# EAGLE design leistung (EAGLE 9.1.3)

## Sheet 1 of 7: connectors
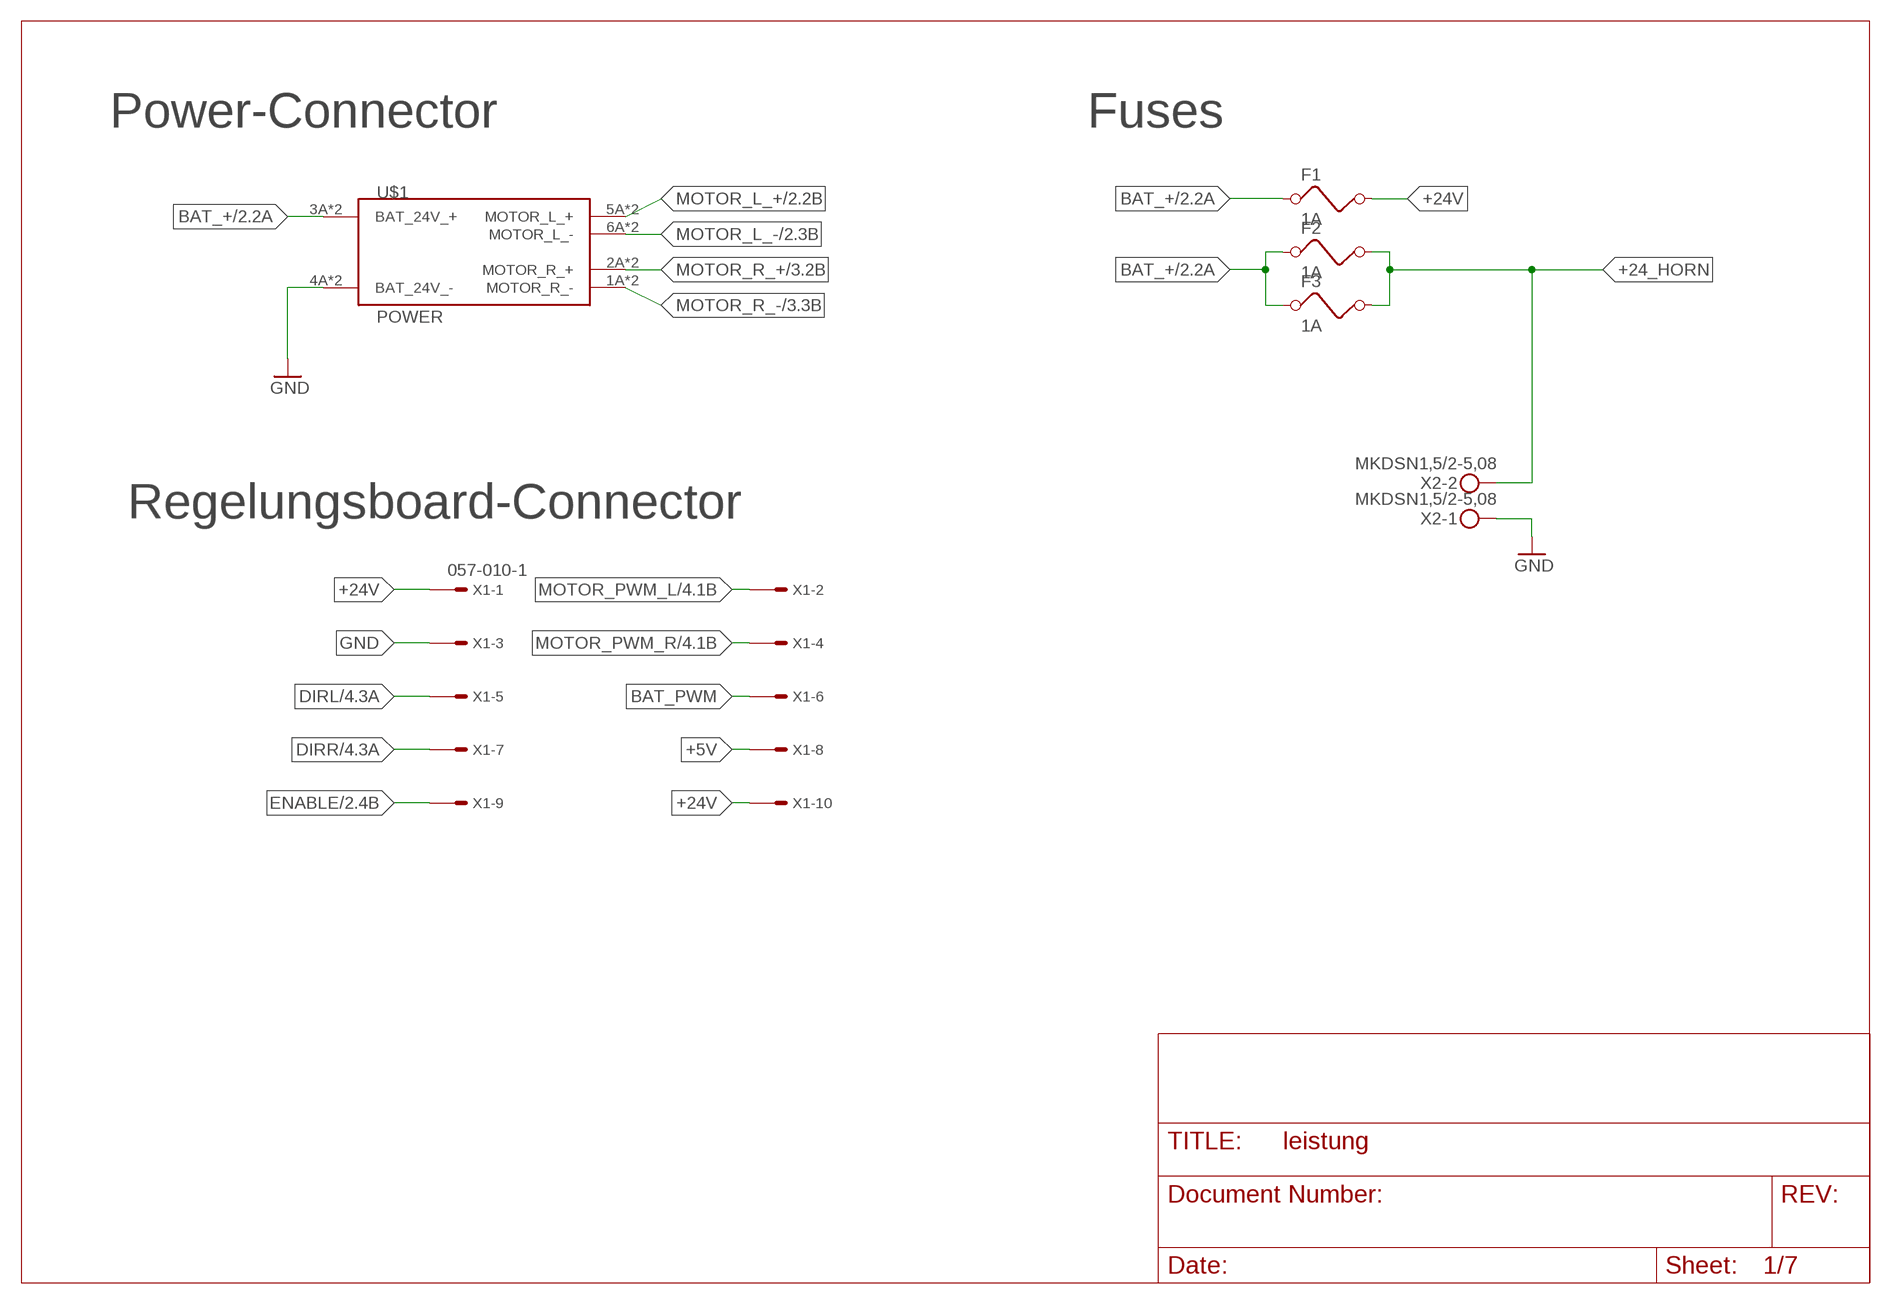
[diagram p0: schematic, sheet 1]

### Parts
F1  1A  FUSE  [FUSE]
F2  1A  FUSE  [FUSE]
F3  1A  FUSE  [FUSE]
U$1  POWER  [CON_POWER]
X1  057-010-1  [057-010-1]
X2  MKDSN1,5/2-5,08  [MKDSN1,5/2-5,08]

### Nets
+5V: X1.8 ; also sheet 4,5,7
+24_HORN: F2.2 F3.2 X2.2
+24V: F1.2 X1.1 X1.10 ; also sheet 5,6,7
BAT_+: F1.1 F2.1 F3.1 U$1.3A(BAT_24V_+) U$1.3B(BAT_24V_+) ; also sheet 2,3
BAT_PWM: X1.6 ; also sheet 7
DIRL: X1.5 ; also sheet 4
DIRR: X1.7 ; also sheet 4
ENABLE: X1.9 ; also sheet 2,3
GND: U$1.4A(BAT_24V_-) U$1.4B(BAT_24V_-) X1.3 X2.1 ; also sheet 2,3,4,5,6,7
MOTOR_L_+: U$1.5A(MOTOR_L_+) U$1.5B(MOTOR_L_+) ; also sheet 2
MOTOR_L_-: U$1.6A(MOTOR_L_-) U$1.6B(MOTOR_L_-) ; also sheet 2
MOTOR_PWM_L: X1.2 ; also sheet 4
MOTOR_PWM_R: X1.4 ; also sheet 4
MOTOR_R_+: U$1.2A(MOTOR_R_+) U$1.2B(MOTOR_R_+) ; also sheet 3
MOTOR_R_-: U$1.1A(MOTOR_R_-) U$1.1B(MOTOR_R_-) ; also sheet 3

### Notes on the sheet
- Power-Connector | Fuses
- Regelungsboard-Connector

## Sheet 2 of 7: h-bridge-left
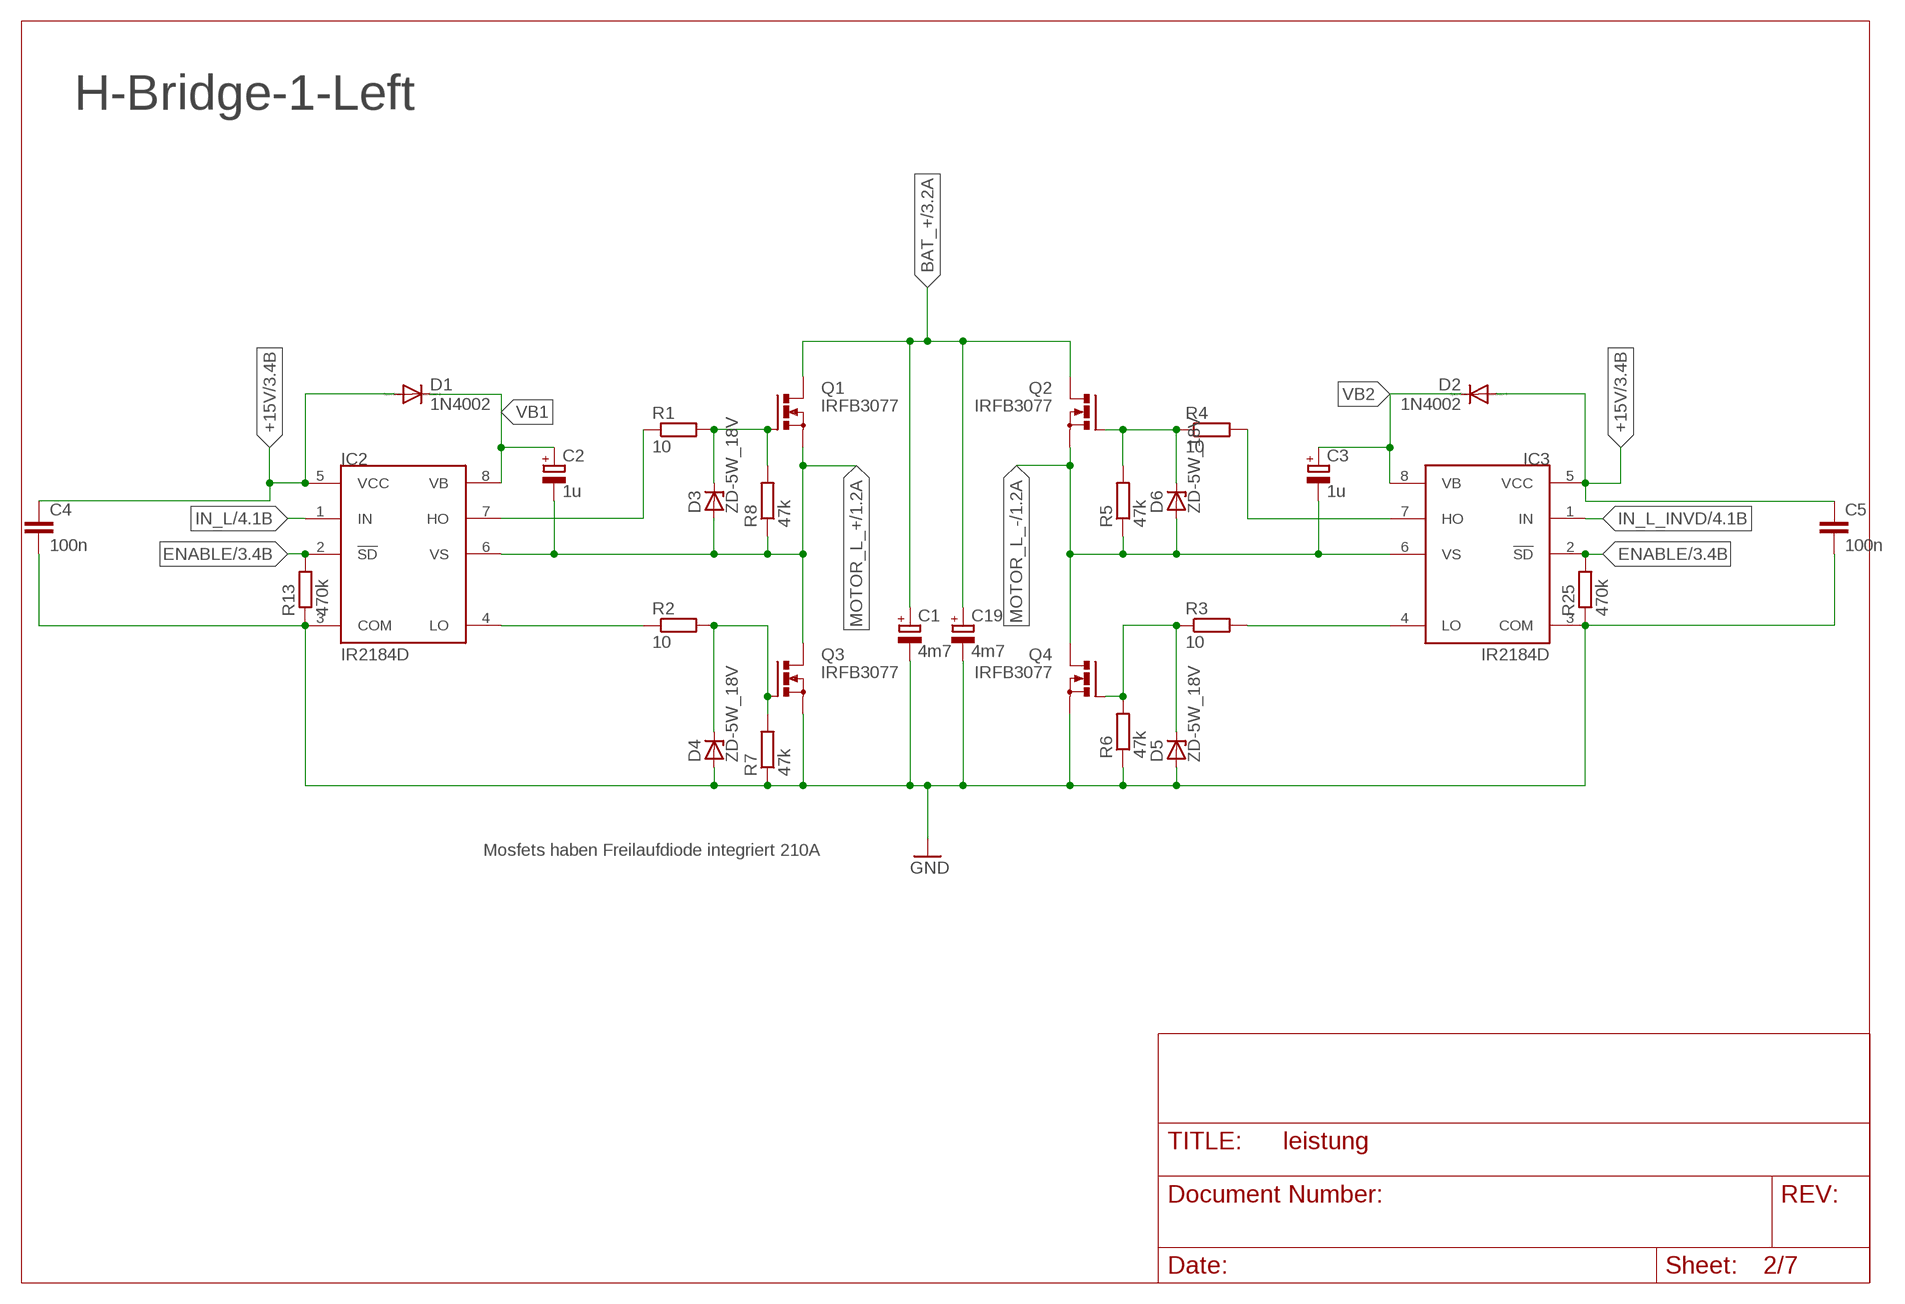
[diagram p1: schematic, sheet 2]

### Parts
C1  4m7  CPOL-EUE7.5-18  [E7,5-18]
C2  1u  CPOL-EUE2.5-5  [E2,5-5]
C3  1u  CPOL-EUE2.5-5  [E2,5-5]
C4  100n  C-EU025-025X050  [C025-025X050]
C5  100n  C-EU025-025X050  [C025-025X050]
C19  4m7  CPOL-EUE7.5-18  [E7,5-18]
D1  1N4002  1N4004  [DO41-10]
D2  1N4002  1N4004  [DO41-10]
D3  ZD-5W_18V  ZENER-DIODEZD-10  [ZDIO-10]
D4  ZD-5W_18V  ZENER-DIODEZD-10  [ZDIO-10]
D5  ZD-5W_18V  ZENER-DIODEZD-10  [ZDIO-10]
D6  ZD-5W_18V  ZENER-DIODEZD-10  [ZDIO-10]
IC2  IR2184D  [DIL08]
IC3  IR2184D  [DIL08]
Q1  IRFB3077  PMOSFET_NTO220BV  [TO220BV]
Q2  IRFB3077  PMOSFET_NTO220BV  [TO220BV]
Q3  IRFB3077  PMOSFET_NTO220BV  [TO220BV]
Q4  IRFB3077  PMOSFET_NTO220BV  [TO220BV]
R1  10  R-EU_0207/7  [0207/7]
R2  10  R-EU_0207/7  [0207/7]
R3  10  R-EU_0207/7  [0207/7]
R4  10  R-EU_0207/7  [0207/7]
R5  47k  R-EU_0207/7  [0207/7]
R6  47k  R-EU_0207/7  [0207/7]
R7  47k  R-EU_0207/7  [0207/7]
R8  47k  R-EU_0207/7  [0207/7]
R13  470k  R-EU_0207/7  [0207/7]
R25  470k  R-EU_0207/7  [0207/7]

### Nets
+15V: C4.1 C5.1 D1.A D2.A IC2.5(VCC) IC3.5(VCC) ; also sheet 3,6
BAT_+: C1.+ C19.+ Q1.D Q2.D ; also sheet 1,3
ENABLE: IC2.2(!SD) IC3.2(!SD) R13.2 R25.2 ; also sheet 1,3
GND: C1.- C4.2 C5.2 C19.- D4.A D5.A IC2.3(COM) IC3.3(COM) Q3.S Q4.S R6.1 R7.1 R13.1 R25.1 ; also sheet 1,3,4,5,6,7
IN_L: IC2.1(IN) ; also sheet 4
IN_L_INVD: IC3.1(IN) ; also sheet 4
MOTOR_L_+: C2.- D3.A IC2.6(VS) Q1.S Q3.D R8.1 ; also sheet 1
MOTOR_L_-: C3.- D6.A IC3.6(VS) Q2.S Q4.D R5.1 ; also sheet 1
N$5: D4.C Q3.G R2.2 R7.2
N$6: D3.C Q1.G R1.2 R8.2
N$7: D6.C Q2.G R4.1 R5.2
N$8: D5.C Q4.G R3.1 R6.2
N$9: IC2.4(LO) R2.1
N$10: IC2.7(HO) R1.1
N$11: IC3.7(HO) R4.2
N$12: IC3.4(LO) R3.2
VB1: C2.+ D1.C IC2.8(VB)
VB2: C3.+ D2.C IC3.8(VB)

### Notes on the sheet
- H-Bridge-1-Left
- Mosfets haben Freilaufdiode integriert 210A

## Sheet 3 of 7: h-bridge-right
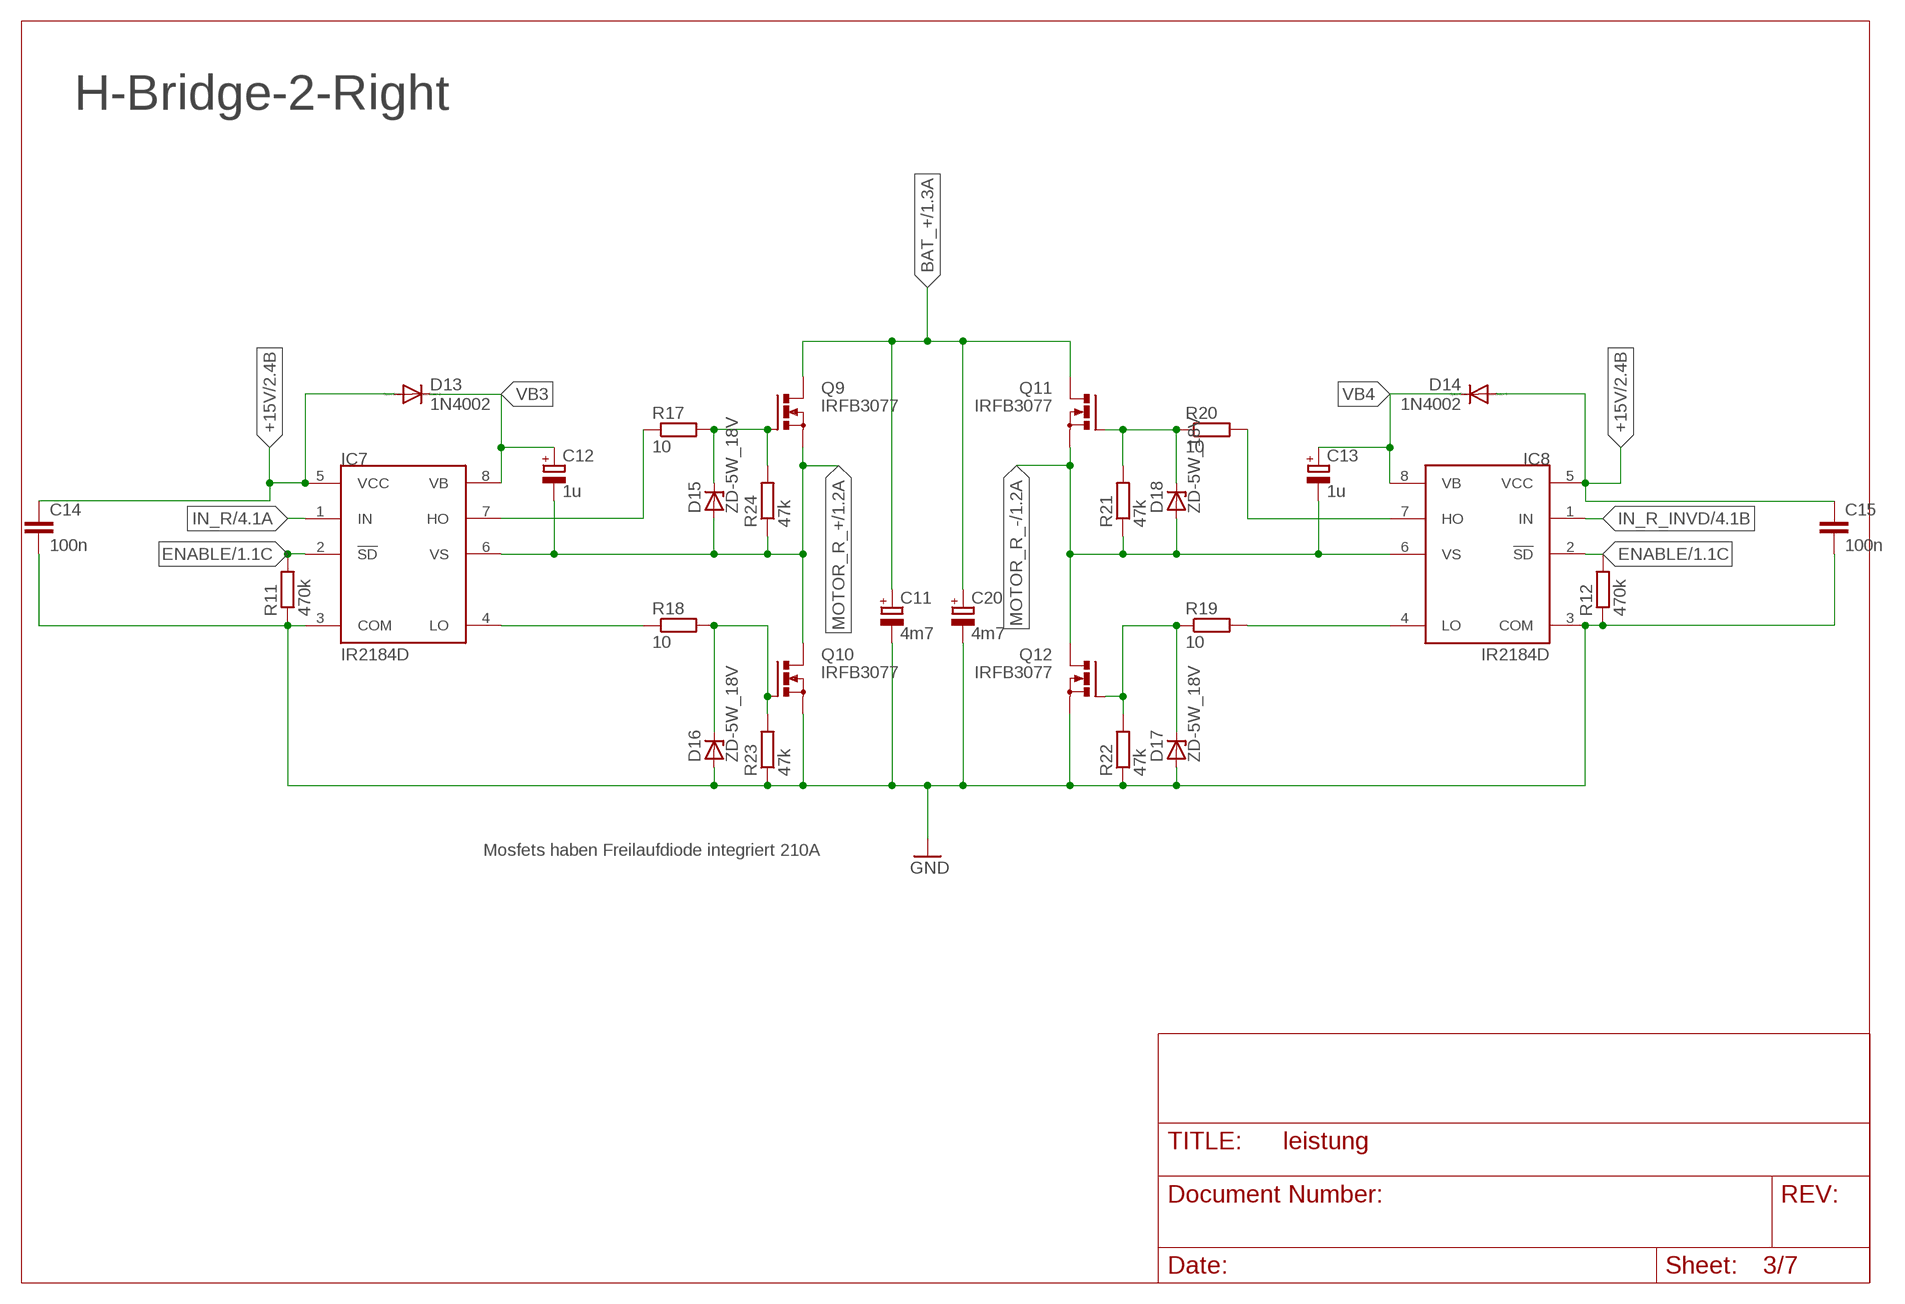
[diagram p2: schematic, sheet 3]

### Parts
C11  4m7  CPOL-EUE7.5-18  [E7,5-18]
C12  1u  CPOL-EUE2.5-5  [E2,5-5]
C13  1u  CPOL-EUE2.5-5  [E2,5-5]
C14  100n  C-EU025-025X050  [C025-025X050]
C15  100n  C-EU025-025X050  [C025-025X050]
C20  4m7  CPOL-EUE7.5-18  [E7,5-18]
D13  1N4002  1N4004  [DO41-10]
D14  1N4002  1N4004  [DO41-10]
D15  ZD-5W_18V  ZENER-DIODEZD-10  [ZDIO-10]
D16  ZD-5W_18V  ZENER-DIODEZD-10  [ZDIO-10]
D17  ZD-5W_18V  ZENER-DIODEZD-10  [ZDIO-10]
D18  ZD-5W_18V  ZENER-DIODEZD-10  [ZDIO-10]
IC7  IR2184D  [DIL08]
IC8  IR2184D  [DIL08]
Q9  IRFB3077  PMOSFET_NTO220BV  [TO220BV]
Q10  IRFB3077  PMOSFET_NTO220BV  [TO220BV]
Q11  IRFB3077  PMOSFET_NTO220BV  [TO220BV]
Q12  IRFB3077  PMOSFET_NTO220BV  [TO220BV]
R11  470k  R-EU_0207/7  [0207/7]
R12  470k  R-EU_0207/7  [0207/7]
R17  10  R-EU_0207/7  [0207/7]
R18  10  R-EU_0207/7  [0207/7]
R19  10  R-EU_0207/7  [0207/7]
R20  10  R-EU_0207/7  [0207/7]
R21  47k  R-EU_0207/7  [0207/7]
R22  47k  R-EU_0207/7  [0207/7]
R23  47k  R-EU_0207/7  [0207/7]
R24  47k  R-EU_0207/7  [0207/7]

### Nets
+15V: C14.1 C15.1 D13.A D14.A IC7.5(VCC) IC8.5(VCC) ; also sheet 2,6
BAT_+: C11.+ C20.+ Q9.D Q11.D ; also sheet 1,2
ENABLE: IC7.2(!SD) IC8.2(!SD) R11.2 R12.2 ; also sheet 1,2
GND: C11.- C14.2 C15.2 C20.- D16.A D17.A IC7.3(COM) IC8.3(COM) Q10.S Q12.S R11.1 R12.1 R22.1 R23.1 ; also sheet 1,2,4,5,6,7
IN_R: IC7.1(IN) ; also sheet 4
IN_R_INVD: IC8.1(IN) ; also sheet 4
MOTOR_R_+: C12.- D15.A IC7.6(VS) Q9.S Q10.D R24.1 ; also sheet 1
MOTOR_R_-: C13.- D18.A IC8.6(VS) Q11.S Q12.D R21.1 ; also sheet 1
N$13: D16.C Q10.G R18.2 R23.2
N$30: D15.C Q9.G R17.2 R24.2
N$31: D18.C Q11.G R20.1 R21.2
N$32: D17.C Q12.G R19.1 R22.2
N$33: IC7.4(LO) R18.1
N$34: IC7.7(HO) R17.1
N$35: IC8.7(HO) R20.2
N$36: IC8.4(LO) R19.2
VB3: C12.+ D13.C IC7.8(VB)
VB4: C13.+ D14.C IC8.8(VB)

### Notes on the sheet
- H-Bridge-2-Right
- Mosfets haben Freilaufdiode integriert 210A

## Sheet 4 of 7: driver-logic-gates
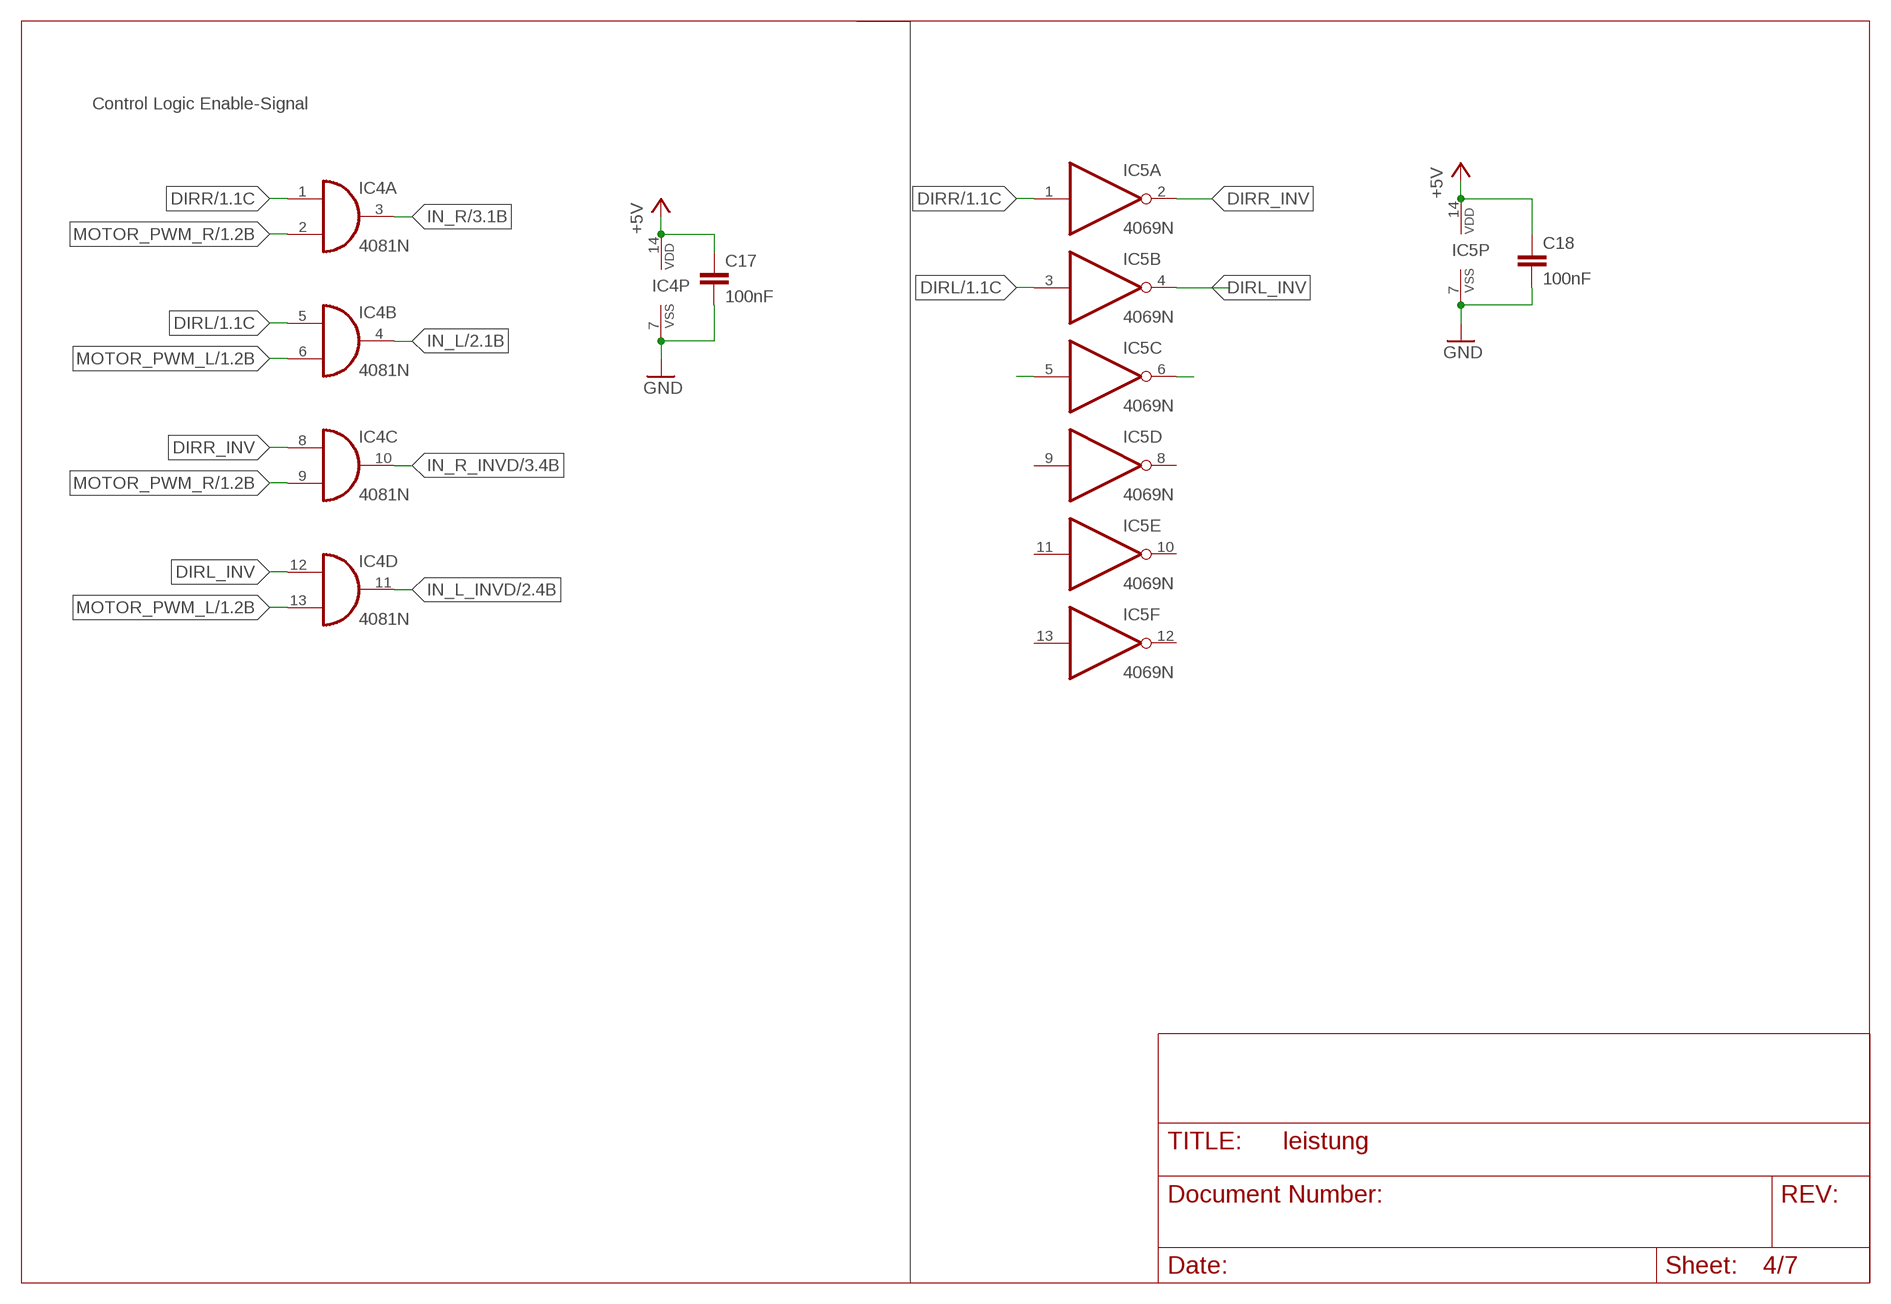
[diagram p3: schematic, sheet 4]

### Parts
C17  100nF  C-EU025-025X050  [C025-025X050]
C18  100nF  C-EU025-025X050  [C025-025X050]
IC4  4081N  [DIL14]
IC5  4069N  [DIL14]

### Nets
+5V: C17.1 C18.1 IC4.14(P:VDD) IC5.14(P:VDD) ; also sheet 1,5,7
DIRL: IC4.5(B:I0) IC5.3(B:I) ; also sheet 1
DIRL_INV: IC4.12(D:I0) IC5.4(B:O)
DIRR: IC4.1(A:I0) IC5.1(A:I) ; also sheet 1
DIRR_INV: IC4.8(C:I0) IC5.2(A:O)
GND: C17.2 C18.2 IC4.7(P:VSS) IC5.7(P:VSS) ; also sheet 1,2,3,5,6,7
IN_L: IC4.4(B:O) ; also sheet 2
IN_L_INVD: IC4.11(D:O) ; also sheet 2
IN_R: IC4.3(A:O) ; also sheet 3
IN_R_INVD: IC4.10(C:O) ; also sheet 3
MOTOR_PWM_L: IC4.6(B:I1) IC4.13(D:I1) ; also sheet 1
MOTOR_PWM_R: IC4.2(A:I1) IC4.9(C:I1) ; also sheet 1
N$19: IC5.6(C:O)
N$20: IC5.5(C:I)
Unconnected: IC5.8(D:O) IC5.9(D:I) IC5.10(E:O) IC5.11(E:I) IC5.12(F:O) IC5.13(F:I)

### Notes on the sheet
- Control Logic Enable-Signal

## Sheet 5 of 7: stepdown-5V
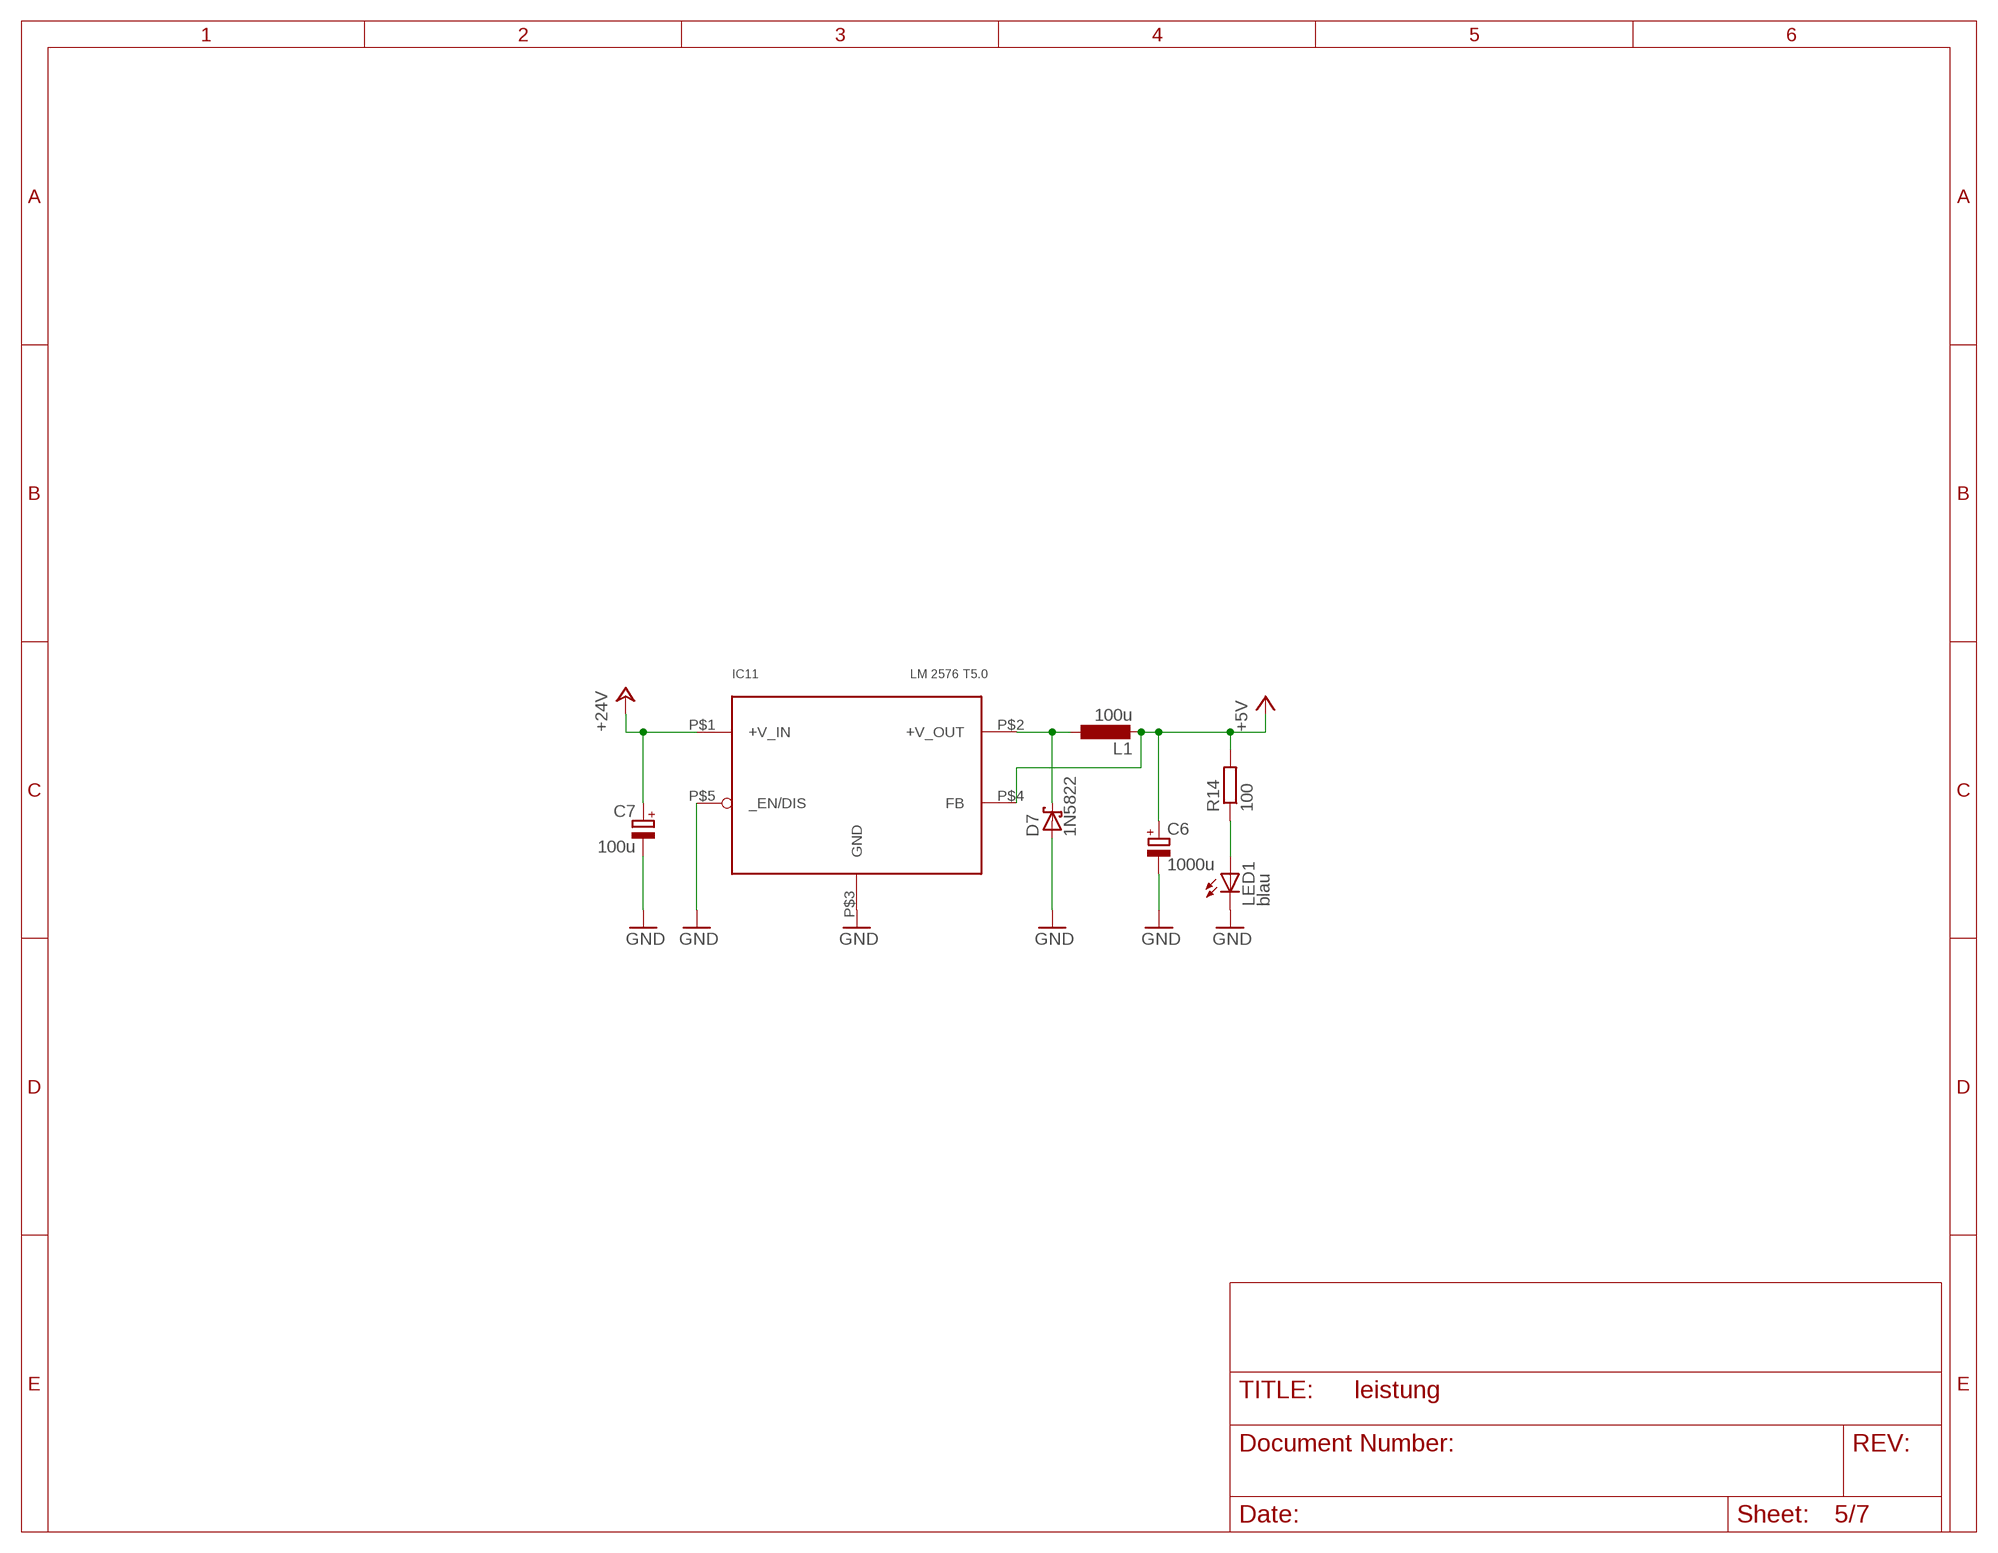
[diagram p4: schematic, sheet 5]

### Parts
C6  1000u  CPOL-EUE5-13  [E5-13]
C7  100u  CPOL-EUE2.5-5V  [E2,5-4R]
D7  1N5822  SCHOTTKY-DIODECB417-15  [CB417-15]
IC11  LM 2576 T5.0  LM2576-T05D  [TO220-5_STAGGERED]
L1  100u  L-EU0207/10  [0207/10]
LED1  blau  LED3MM  [LED3MM]
R14  100  R-EU_0207/10  [0207/10]

### Nets
+5V: C6.+ IC11.P$4(FB) L1.2 R14.2 ; also sheet 1,4,7
+24V: C7.+ IC11.P$1(+V_IN) ; also sheet 1,6,7
GND: C6.- C7.- D7.A IC11.P$3(GND) IC11.P$5(_EN/DIS) LED1.K(C) ; also sheet 1,2,3,4,6,7
N$1: D7.C IC11.P$2(+V_OUT) L1.1
N$2: LED1.A R14.1

## Sheet 6 of 7: stepdown-15V
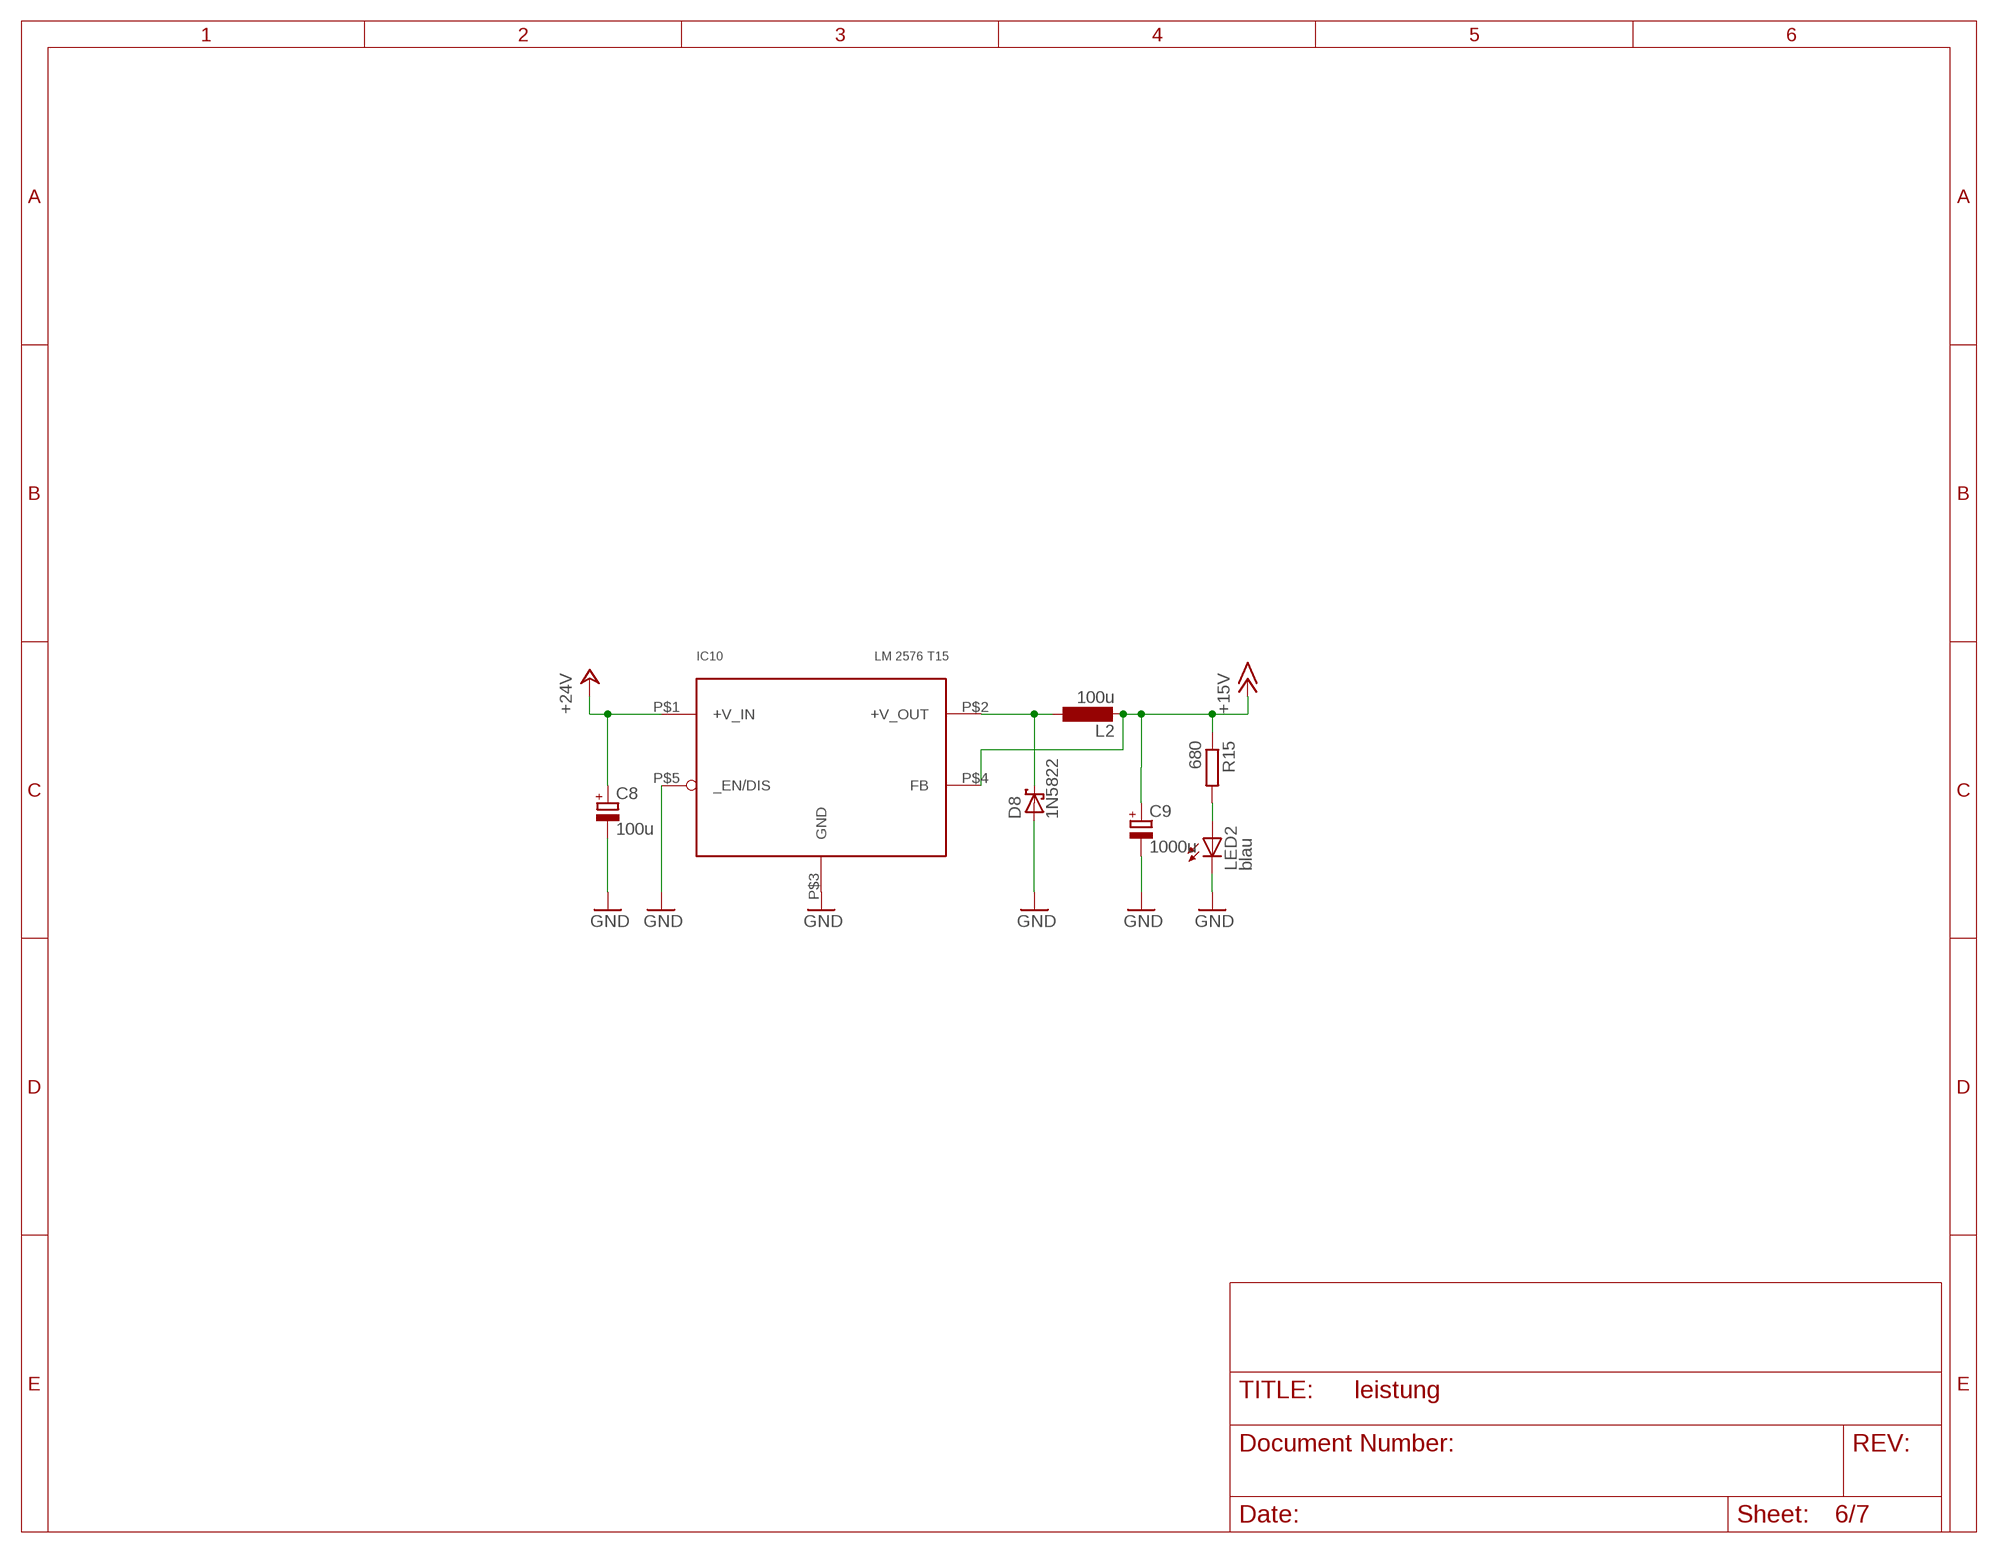
[diagram p5: schematic, sheet 6]

### Parts
C8  100u  CPOL-EUE2.5-7  [E2,5-7]
C9  1000u  CPOL-EUE5-13  [E5-13]
D8  1N5822  SCHOTTKY-DIODECB429-15  [CB429-15]
IC10  LM 2576 T15  LM2576-T05D  [TO220-5_STAGGERED]
L2  100u  L-EU0207/10  [0207/10]
LED2  blau  LED3MM  [LED3MM]
R15  680  R-EU_0207/10  [0207/10]

### Nets
+15V: C9.+ IC10.P$4(FB) L2.2 R15.1 ; also sheet 2,3
+24V: C8.+ IC10.P$1(+V_IN) ; also sheet 1,5,7
GND: C8.- C9.- D8.A IC10.P$3(GND) IC10.P$5(_EN/DIS) LED2.K(C) ; also sheet 1,2,3,4,5,7
N$3: LED2.A R15.2
N$4: D8.C IC10.P$2(+V_OUT) L2.1

## Sheet 7 of 7: ATTiny13-PWM
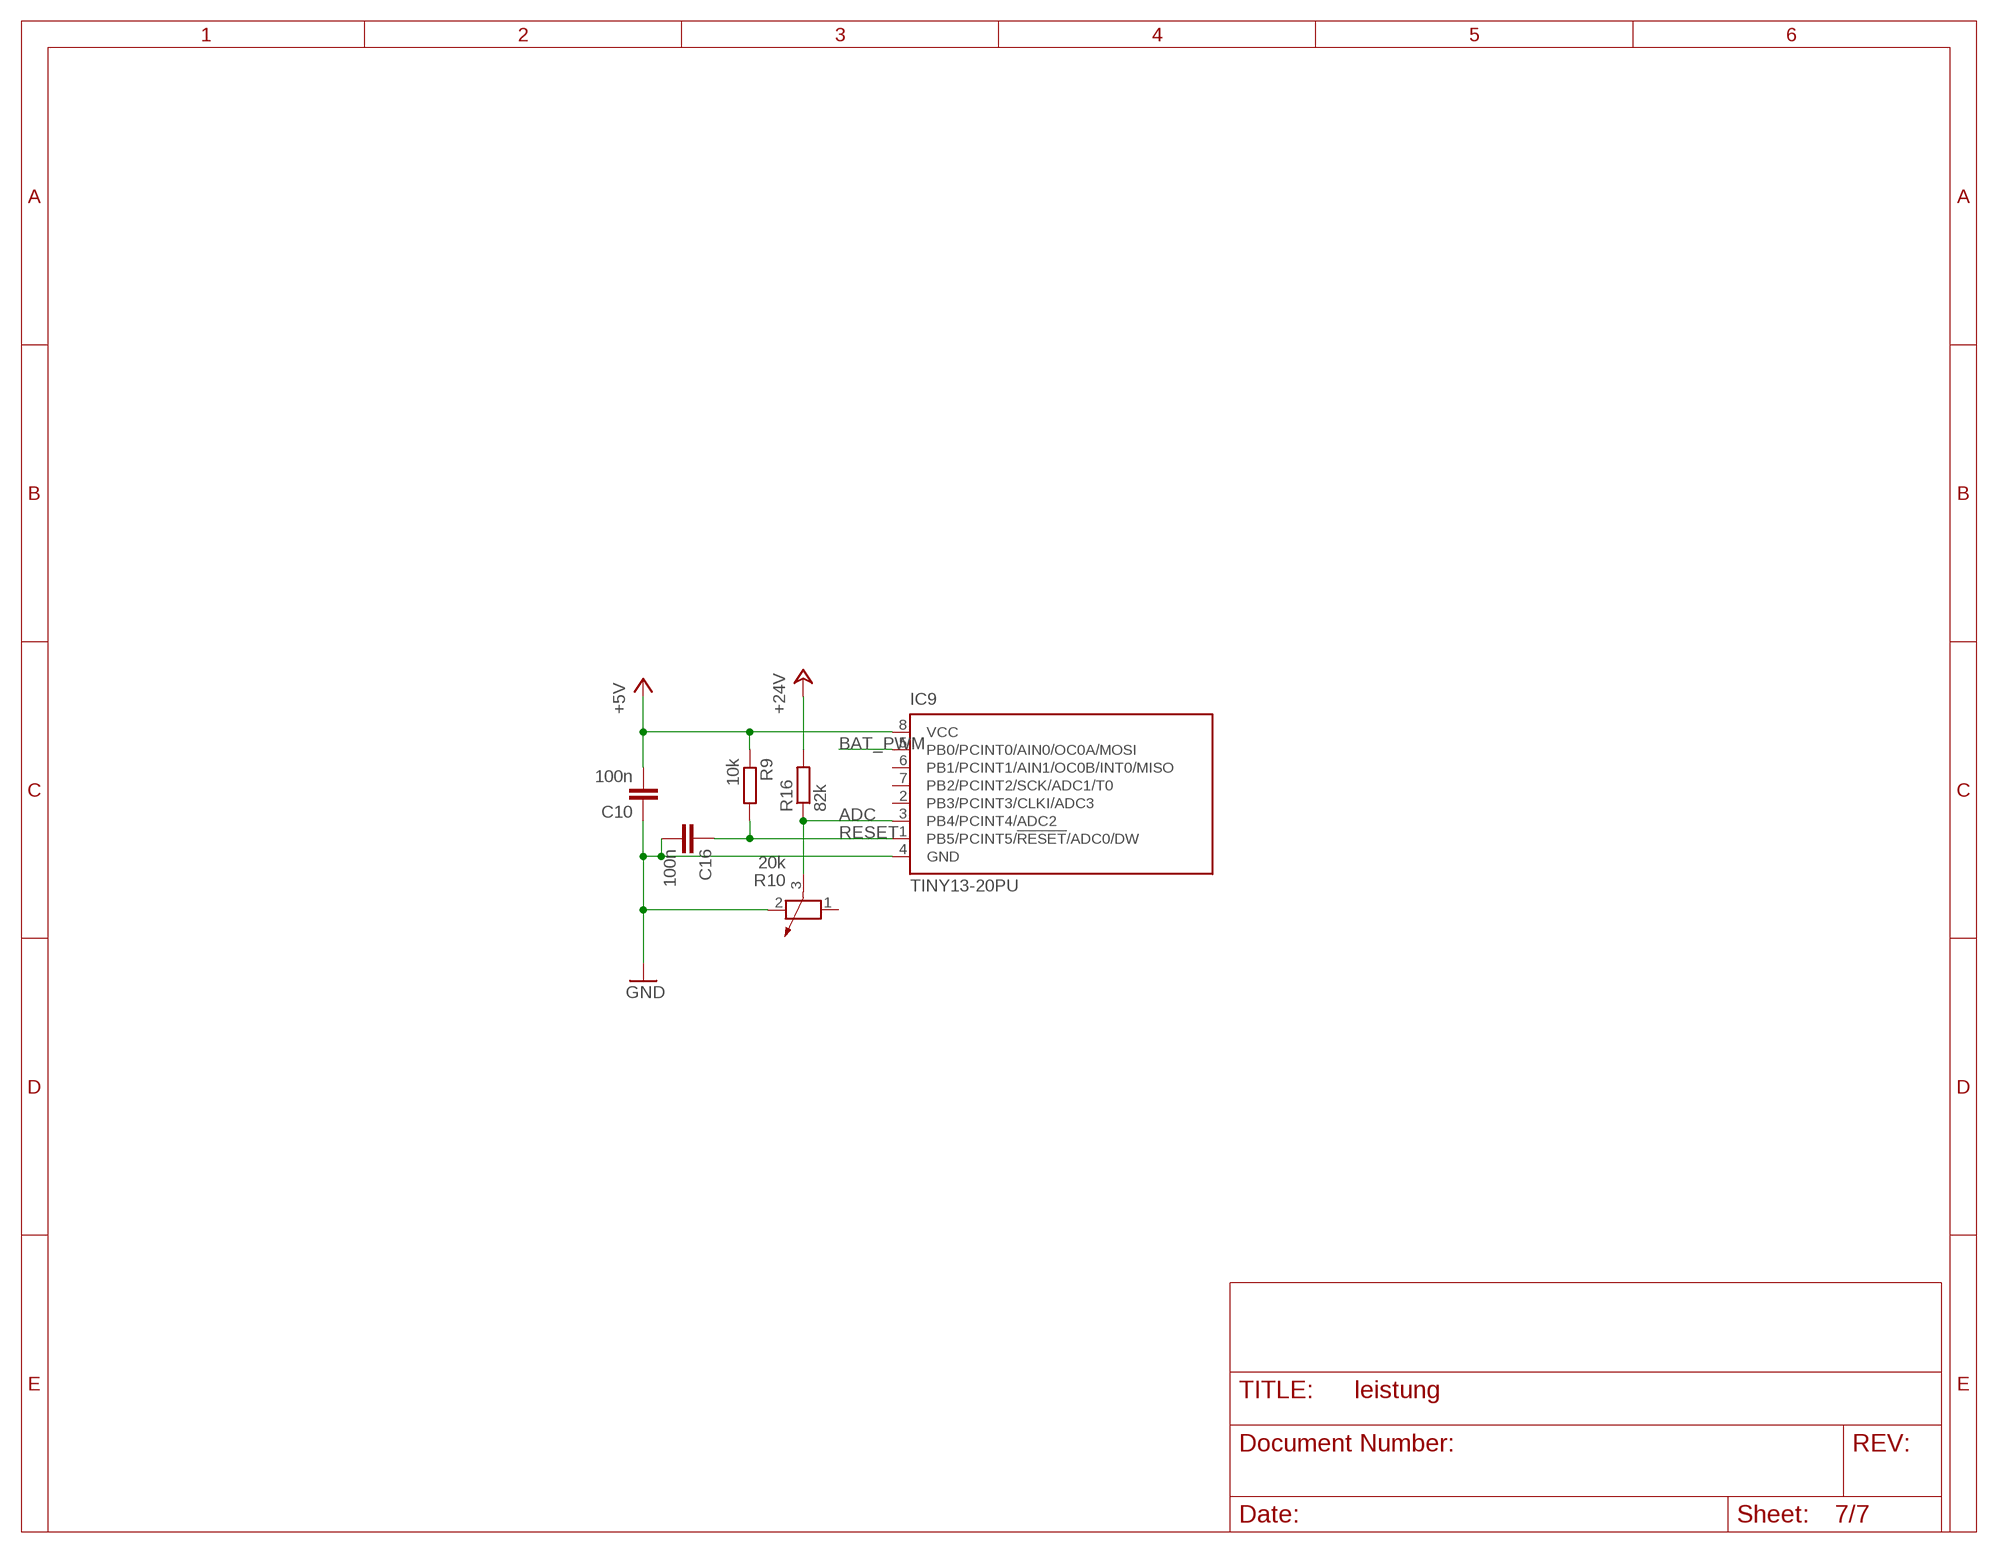
[diagram p6: schematic, sheet 7]

### Parts
C10  100n  C-EU025-025X050  [C025-025X050]
C16  100n  C-EU025-025X050  [C025-025X050]
IC9  TINY13-20PU  [DIL08]
R9  10k  R-EU_0207/10  [0207/10]
R10  20k  POTENTIOMETER_PT-10  [PT-10]
R16  82k  R-EU_0207/10  [0207/10]

### Nets
+5V: C10.2 IC9.8(VCC) R9.1 ; also sheet 1,4,5
+24V: R16.2 ; also sheet 1,5,6
ADC: IC9.3(PB4/PCINT4/ADC2) R10.3 R16.1
BAT_PWM: IC9.5(PB0/PCINT0/AIN0/OC0A/MOSI) ; also sheet 1
GND: C10.1 C16.2 IC9.4(GND) R10.2 ; also sheet 1,2,3,4,5,6
RESET: C16.1 IC9.1(PB5/PCINT5/!RESET!/ADC0/DW) R9.2
Unconnected: IC9.2(PB3/PCINT3/CLKI/ADC3) IC9.6(PB1/PCINT1/AIN1/OC0B/INT0/MISO) IC9.7(PB2/PCINT2/SCK/ADC1/T0) R10.1

## Library data of the parts
C1-C3 C6 C9 C11-C13 C19 C20 = rcl:CPOL-EU: POLARIZED CAPACITOR, European symbol; SPICEPREFIX: C
C4 C5 C14 C15 C17 C18 = rcl:C-EU: CAPACITOR, European symbol; SPICEPREFIX: C
C7 C8 = rcl:CPOL-EU: POLARIZED CAPACITOR, European symbol
C10 C16 = rcl:C-EU: CAPACITOR, European symbol
D1 D2 D13 D14 = diode:1N4004: DIODE general purpose rectifier, 1 A
D3-D6 D15-D18 = diode:ZENER-DIODE: Z-Diode
D7 D8 = diode:SCHOTTKY-DIODE: Schottky Diode
F1-F3 = special:FUSE: FUSE 5 x 20 mm
IC2 IC3 IC7 IC8 = irs:IR2184
IC4 = 40xx:4081: Quad 2-input AND
IC5 = 40xx:4069: Hex INVERTER
IC9 = atmel:TINY13: 8-bit AVR Microcontroller with 1K Bytes In-System Programmable Flash Source: http://www.atmel.com/dyn/resources/prod_documents/2535S.pdf; MPN: ATTINY13-20PU; OC_FARNELL: 9171550; OC_NEWARK: 96K6521
IC10 IC11 = LM2576:LM2576-T05D: LM2576/LM2576HV Series SIMPLE SWITCHER® 3A Step-Down Voltage Regulator STAGGERED PACKAGE
L1 L2 = rcl:L-EU: INDUCTOR, European symbol
LED1 LED2 = led:LED: LED OSRAM: - CHIPLED LG R971, LG N971, LY N971, LG Q971, LY Q971, LO R971, LY R971 LH N974, LH R974 LS Q976, LO Q976, LY Q976 LO Q996 - Hyper CHIPLED LW Q18S LB Q993, LB Q99A, LB R99A - SideLED LS A670, LO A670, LY A670, LG A670, LP A670 LB A673, LV A673, LT A673, LW A673 LH A674 LY A675 LS A676, LA A676, LO A676, LY A676, LW A676 LS A679, LY A679, LG A679 - Hyper Micro SIDELED® LS Y876, LA Y876, LO Y876, LY Y876 LT Y87S - SmartLED LW L88C, LW L88S LB L89C, LB L89S, LG L890 LS L89K, LO L89K, LY L89K LS L896, LA L896, LO L896, LY L896 - TOPLED LS T670, LO T670, LY T670, LG T670, LP T670 LSG T670, LSP T670, LSY T670, LOP T670, LYG T670 LG T671, LOG T671, LSG T671 LB T673, LV T673, LT T673, LW T673 LH T674 LS T676, LA T676, LO T676, LY T676, LB T676, LH T676, LSB T676, LW T676 LB T67C, LV T67C, LT T67C, LS T67K, LO T67K, LY T67K, LW E67C LS E67B, LA E67B, LO E67B, LY E67B, LB E67C, LV E67C, LT E67C LW T67C LS T679, LY T679, LG T679 LS T770, LO T770, LY T770, LG T770, LP T770 LB T773, LV T773, LT T773, LW T773 LH T774 LS E675, LA E675, LY E675, LS T675 LS T776, LA T776, LO T776, LY T776, LB T776 LHGB T686 LT T68C, LB T68C - Hyper Mini TOPLED® LB M676 - Mini TOPLED Santana® LG M470 LS M47K, LO M47K, LY M47K Source: http://www.osram.convergy.de LUXEON: - LUMILED® LXK2-PW12-R00, LXK2-PW12-S00, LXK2-PW14-U00, LXK2-PW14-V00 LXK2-PM12-R00, LXK2-PM12-S00, LXK2-PM14-U00 LXK2-PE12-Q00, LXK2-PE12-R00, LXK2-PE12-S00, LXK2-PE14-T00, LXK2-PE14-U00 LXK2-PB12-K00, LXK2-PB12-L00, LXK2-PB12-M00, LXK2-PB14-N00, LXK2-PB14-P00, LXK2-PB14-Q00 LXK2-PR12-L00, LXK2-PR12-M00, LXK2-PR14-Q00, LXK2-PR14-R00 LXK2-PD12-Q00, LXK2-PD12-R00, LXK2-PD12-S00 LXK2-PH12-R00, LXK2-PH12-S00 LXK2-PL12-P00, LXK2-PL12-Q00, LXK2-PL12-R00 Source: www.luxeon.com KINGBRIGHT: KA-3528ASYC Source: www.kingbright.com
Q1-Q4 Q9-Q12 = transistor-power:PMOSFET_N: Power MOSFET N-Channel
R1-R8 R11-R13 R17-R25 = rcl:R-EU_: RESISTOR, European symbol; SPICEPREFIX: R
R9 R14-R16 = rcl:R-EU_: RESISTOR, European symbol
R10 = rcl:POTENTIOMETER_: Potentiometer; SPICEMODEL: POT; SPICEPREFIX: X
U$1 = lsd2016:POWER
X1 = con-panduit:057-010-: CONNECTOR 10-pin series 057 contact pc board low profile headers; OC_FARNELL: unknown; OC_NEWARK: unknown
X2 = con-phoenix-508:MKDSN1,5/2-5,08: MKDSN 1,5/ 2-5,08 Printklemme Nennstrom: 13,5 A Nennspannung: 250 V Rastermaß: 5,08 mm Polzahl: 2 Anschlussart: Schraubanschluss Montage: Löten Anschlussrichtung Leiter/Platine: 0 ° Artikelnummer: 1729128 Source: http://eshop.phoenixcontact.com .. 1729128.pdf

## Board
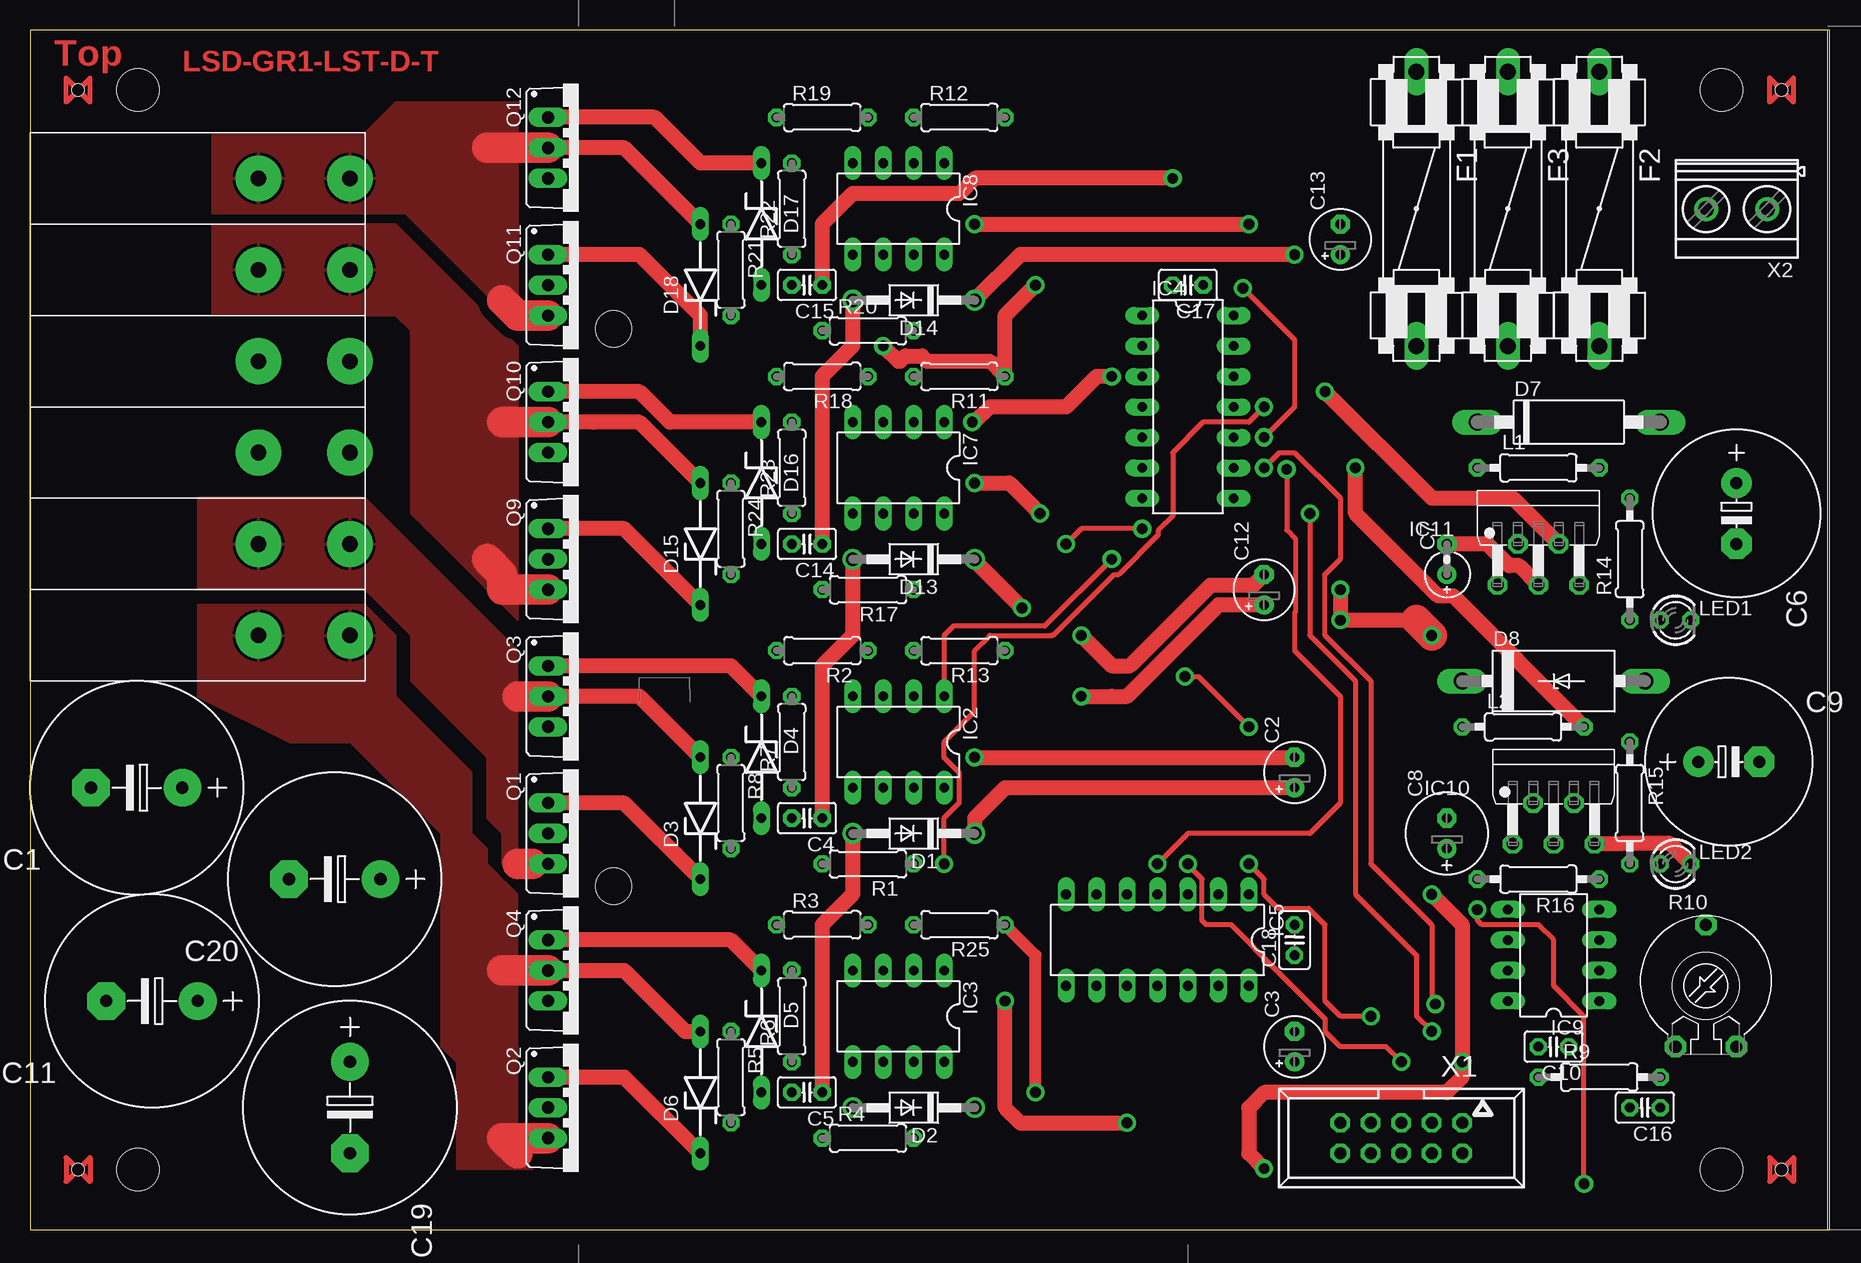
[diagram p7: board, top side]
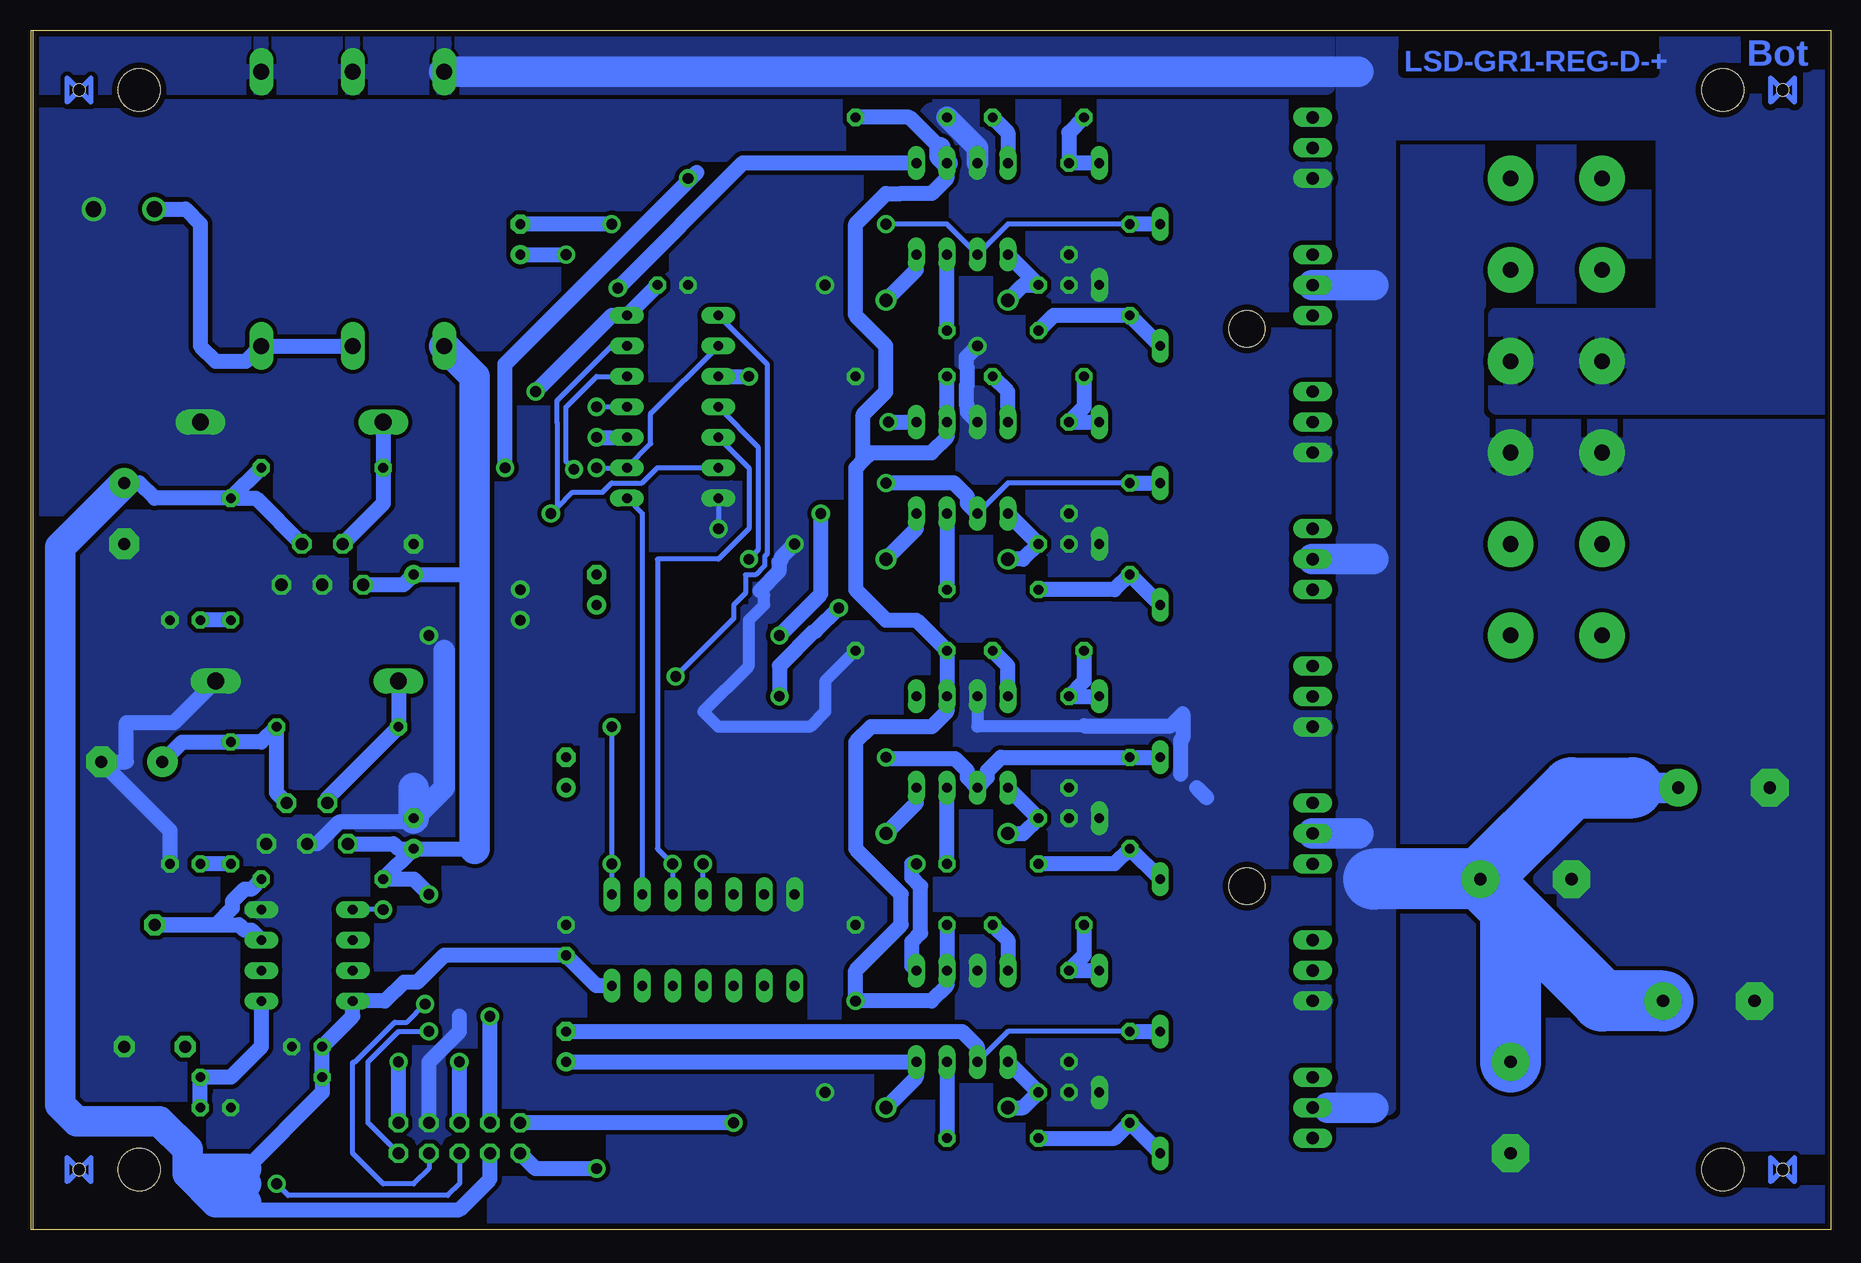
[diagram p8: board, bottom side, seen from below]

Size 149.84 x 100 mm. Coordinates in mm from the lower left corner, seen from the top.
Outline: 0,0 149.84,0 149.84,100 0,100 0,0
Copper layers (1*16): Top 0.035mm / dielectric 1.5mm / Bottom 0.035mm
Design rules "default *": minimum track width 6mil, minimum drill 0.8mm, track to track 14mil, track to pad 14mil, pad to pad 14mil, via to via 14mil, smd to smd 14mil, copper to edge 20mil, drill to drill 6mil, minimum pad ring 12mil, minimum via ring 12mil, stop-mask expansion 6mil, vias tented up to drill 0mil, thermal gap 10mil
Holes 3 mm at 48.65,28.62 48.65,75.08

### Footprints (pad centres in the part's own frame; a part is rotated, then mirrored left to right if it is on the bottom)
E7,5-18 = drill 1.016 pad 3.15: + -3.81,0 | drill 1.016 pad 3.15 octagon: - 3.81,0
E2,5-5 = drill 0.813 pad 1.6: + -1.27,0 | drill 0.813 pad 1.6 octagon: - 1.27,0
C025-025X050 = drill 0.813 octagon: 1 -1.27,0; 2 1.27,0
E5-13 = drill 1.016 pad 2.54: + -2.54,0 | drill 1.016 pad 2.54 octagon: - 2.54,0
E2,5-4R = drill 0.813 pad 1.6: + -1.27,0 | drill 0.813 pad 1.6 octagon: - 1.27,0
E2,5-7 = drill 0.813 pad 1.6: + -1.27,0 | drill 0.813 pad 1.6 octagon: - 1.27,0
DO41-10 = drill 1.118: A 5.08,0; C -5.08,0
ZDIO-10 = drill 0.813 long: A 5.08,0; C -5.08,0
CB417-15 = drill 1.397 long: A 7.62,0; C -7.62,0
CB429-15 = drill 1.397 long: A 7.62,0; C -7.62,0
FUSE = drill 1.321 long: 1 -11.43,0; 2 11.43,0
DIL08 = drill 0.813 long: 1 -3.81,-3.81; 2 -1.27,-3.81; 3 1.27,-3.81; 4 3.81,-3.81; 5 3.81,3.81; 6 1.27,3.81; 7 -1.27,3.81; 8 -3.81,3.81
DIL14 = drill 0.813 long: 1 -7.62,-3.81; 2 -5.08,-3.81; 3 -2.54,-3.81; 4 0,-3.81; 5 2.54,-3.81; 6 5.08,-3.81; 7 7.62,-3.81; 8 7.62,3.81; 9 5.08,3.81; 10 2.54,3.81; 11 0,3.81; 12 -2.54,3.81; 13 -5.08,3.81; 14 -7.62,3.81
TO220-5_STAGGERED = drill 1.016 octagon: P$1 -3.404,-3.404; P$2 -1.702,0; P$3 0,-3.404; P$4 1.702,0; P$5 3.404,-3.404
0207/10 = drill 0.813 octagon: 1 -5.08,0; 2 5.08,0
LED3MM = drill 0.813 octagon: A -1.27,0; K 1.27,0
TO220BV = drill 1.016 long: D 0,-2.54; G -2.54,-2.54; S 2.54,-2.54
0207/7 = drill 0.813 octagon: 1 -3.81,0; 2 3.81,0
PT-10 = drill 1.016 pad 1.778 octagon: 1 -2.54,-5.08; 2 2.54,-5.08; 3 0,5.08
CON_POWER = drill 1.3 pad 3.81: 1A 0,19.05; 1B 7.62,19.05; 2A 0,11.43; 2B 7.62,11.43; 3A 0,3.81; 3B 7.62,3.81; 4A 0,-3.81; 4B 7.62,-3.81; 5A 0,-11.43; 5B 7.62,-11.43; 6A 0,-19.05; 6B 7.62,-19.05
BOARD = hole 3.5: 9,5; 9,95; 141,95; 141,5 | hole 1: 4,95; 146,5; 4,5; 146,95
057-010-1 = drill 1 octagon: 1 -5.08,-1.27; 2 -5.08,1.27; 3 -2.54,-1.27; 4 -2.54,1.27; 5 0,-1.27; 6 0,1.27; 7 2.54,-1.27; 8 2.54,1.27; 9 5.08,-1.27; 10 5.08,1.27
MKDSN1,5/2-5,08 = drill 1.3 pad 2: 1 -2.561,0.025; 2 2.519,0.025

### Placement (x,y rotation side)
C1  8.89,36.83 180 top
C2  105.41,38.1 90 top
C3  105.41,15.24 90 top
C4  64.77,34.29 180 top
C5  64.77,11.43 180 top
C6  142.24,59.69 270 top
C7  118.11,55.88 90 top
C8  118.11,33.02 90 top
C9  141.6,38.99 0 top
C10  127,15.24 180 top
C11  10.16,19.05 180 top
C12  102.87,53.34 90 top
C13  109.22,82.55 90 top
C14  64.77,57.15 180 top
C15  64.77,78.74 180 top
C16  134.62,10.16 180 top
C17  96.52,78.74 180 top
C18  105.41,24.13 90 top
C19  26.67,10.16 270 top
C20  25.4,29.21 180 top
D1  73.66,33.02 180 top
D2  73.66,10.16 180 top
D3  55.88,34.29 90 top
D4  60.96,39.37 270 top
D5  60.96,16.51 270 top
D6  55.88,11.43 90 top
D7  128.27,67.31 0 top
D8  127,45.72 0 top
D13  73.66,55.88 180 top
D14  73.66,77.47 180 top
D15  55.88,57.15 90 top
D16  60.96,62.23 270 top
D17  60.96,83.82 270 top
D18  55.88,78.74 90 top
F1  115.57,85.09 270 top
F2  130.81,85.09 270 top
F3  123.19,85.09 270 top
IC2  72.39,40.64 180 top
IC3  72.39,17.78 180 top
IC4  96.52,68.58 270 top
IC5  93.98,24.13 180 top
IC7  72.39,63.5 180 top
IC8  72.39,85.09 180 top
IC9  127,22.86 90 top
IC10  127,35.56 0 top
IC11  125.73,57.15 0 top
L1  125.73,63.5 0 top
L2  124.46,41.91 0 top
LED1  137.16,50.8 0 top
LED2  137.16,30.48 0 top
Q1  45.72,33.02 270 top
Q2  45.72,10.16 270 top
Q3  45.72,44.45 270 top
Q4  45.72,21.59 270 top
Q9  45.72,55.88 270 top
Q10  45.72,67.31 270 top
Q11  45.72,78.74 270 top
Q12  45.72,90.17 270 top
R1  69.85,30.48 180 top
R2  66.04,48.26 180 top
R3  66.04,25.4 0 top
R4  69.85,7.62 0 top
R5  58.42,12.7 270 top
R6  63.5,17.78 90 top
R7  63.5,40.64 90 top
R8  58.42,35.56 270 top
R9  130.81,12.7 0 top
R10  139.7,20.32 0 top
R11  77.47,71.12 180 top
R12  77.47,92.71 0 top
R13  77.47,48.26 180 top
R14  133.35,55.88 90 top
R15  133.35,35.56 270 top
R16  125.73,29.21 180 top
R17  69.85,53.34 180 top
R18  66.04,71.12 180 top
R19  66.04,92.71 0 top
R20  69.85,74.93 0 top
R21  58.42,80.01 270 top
R22  63.5,85.09 90 top
R23  63.5,63.5 90 top
R24  58.42,58.42 270 top
R25  77.47,25.4 180 top
U$1  19.05,68.58 0 top
U$2  [BOARD]  0,0 0 top
X1  114.3,7.62 180 top
X2  142.24,85.09 180 top

### Tracks (layer width: path | path; a pad name or v marks a point on that pad's centre or on a via)
+5V  (via drill 0.9)
  Top 1.27: IC11.P$4 123.62,60.96 119.38,60.96 116.84,60.96 v107.95,69.85
  Bottom 1.27: X1.8 111.76,4.19 114.3,1.65 133.35,1.65 133.99,2.29 134.62,2.29 | 132.08,5.08 125.73,11.43 R9.1 C10.2 123.19,17.78 IC9.8 120.5,19.05 118.93,20.62 117.81,20.62 115.57,22.86 C18.1 102.87,20.32 IC5.14 | 132.08,2.29 132.08,3.81 | L1.2 R14.2 | R14.2 131.24,60.96 IC11.P$4 | R14.2 139.7,60.96 140.97,62.23 C6.+ | C17.1 IC4.14 101.6,76.2 v107.95,69.85
  Bottom 2.54: C6.+ 147.55,56.92 147.55,10.39 146.2,9.04 139.33,9.04 136.96,6.67 136.96,4.63 134.62,2.29 132.08,2.29 | 132.08,5.08 135.89,5.08 134.62,3.81 132.08,3.81
+15V  (via drill 0.9)
  Top 1.27: D1.A 68.58,27.94 66.04,25.4 C5.1 | C4.1 66.04,39.37 66.04,46.99 68.58,49.53 68.58,50.8 D13.A | D14.A 68.58,73.66 66.04,71.12 C14.1 | L2.2 118.63,52.82 117.37,52.82 110.49,59.7 v110.49,63.5 | v95.25,87.63 78.74,87.63 77.47,86.36 68.58,86.36 66.04,83.82 C15.1
  Bottom 1.27: IC3.5 C5.1 67.31,10.16 D2.A | IC8.5 C15.1 67.31,78.74 D14.A | IC7.5 C14.1 67.31,55.88 D13.A | IC2.5 C4.1 67.31,33.02 D1.A | IC10.P$4 129.54,36.4 L2.2 130.81,40.64 R15.1 137.41,40.64 C9.+ | v110.49,63.5 110.49,72.15 94.49,88.14 95.01,87.63 v95.25,87.63
+24_HORN
  Bottom 1.27: X2.2 137.13,85.06 135.89,83.82 135.89,73.66 134.62,72.39 132.08,72.39 F2.2 F3.2
+24V  (via drill 0.9)
  Top 1.27: v102.87,5.08 101.6,6.35 101.6,10.16 102.87,11.43 118.11,11.43 119.38,12.7 v119.38,13.97 119.38,25.4 v116.84,27.94
  Bottom 1.27: 113.03,54.61 C7.+ 118.97,53.75 IC11.P$1 | C8.+ 113.03,31.75 | C8.+ R16.2 118.11,29.21 v116.84,27.94 | X1.1 v119.38,13.97 | v102.87,5.08 107.95,5.08 X1.10 | IC10.P$1 119.79,32.16 119.38,31.75 C8.+
  Bottom 2.54: F1.2 113.03,71.12 113.03,54.61 113.03,31.75
ADC
  Bottom 1.27: R16.1 131.65,28.37 132.23,28.37 133.22,27.38 133.22,26.8 134.62,25.4 137.16,25.4 R10.3 132.66,25.4 132.23,24.97 131.65,24.97 IC9.3
BAT_+
  Bottom 1.27: Q2.D 41.91,10.16
  Bottom 2.54: 16.51,36.83 C1.+ | Q1.D 39.37,33.02 | Q9.D 38.1,55.88 | 41.91,10.16 38.1,10.16 | Q11.D 38.1,78.74 | F1.1 39.37,96.52
  Bottom 5.08: C20.+ 21.59,36.83 16.51,36.83 | C19.+ 26.67,26.67 C20.+ | C11.+ 19.05,19.05 C20.+ | C20.+ 38.1,29.21
  pour Bottom (isolate 0.508): 15.24,68.58 0,68.58 0,101.6 40.64,101.6 40.64,10.16 36.83,10.16 36.83,91.44 13.97,91.44 13.97,76.2 27.94,76.2 27.94,68.58
  pour Bottom: 41.91,100.33 149.86,100.33 149.86,95.25 41.91,95.25
BAT_PWM  (via drill 0.9)
  Top 0.406: v129.54,3.81 129.54,17.78 127,20.32 127,24.13 125.73,25.4 121.03,25.4 120.65,25.78 v120.65,26.67
  Bottom 0.406: X1.6 114.3,3.81 115.27,2.85 128.57,2.85 v129.54,3.81 | v120.65,26.67 IC9.5
DIRL  (via drill 0.9)
  Top 0.406: v114.3,13.97 113.03,15.24 110.49,15.24 109.22,15.24 107.95,16.51 107.95,17.58 104.04,21.49 | 104.04,21.49 | 104.04,21.49 100.13,25.4 98.04,25.4 97.69,25.76 97.69,29.21 96.52,30.38 v96.52,30.48
  Bottom 0.406: IC5.3 v96.52,30.48 97.79,31.75 97.79,55.88 92.71,55.88 90.17,58.42 90.17,63.5 IC4.5
  Bottom 1.27: X1.5 v114.3,13.97
DIRL_INV  (via drill 0.9)
  Top 0.406: v93.98,30.48 96.52,33.02 106.68,33.02 109.22,35.56 109.22,44.45 105.41,48.26 105.41,51.42 105.5,51.51 105.5,57.55 104.75,58.29 v104.75,63.37
  Bottom 0.406: IC4.12 102.87,71.12 105.41,68.58 105.41,64.03 v104.75,63.37 | IC5.4 v93.98,30.48
DIRR  (via drill 0.9)
  Top 0.406: v111.76,17.78 109.22,17.78 107.95,19.05 107.95,25.4 106.58,26.77 104.04,26.77 102.87,27.94 102.87,29.21 v101.6,30.48 | v101.6,41.91 97.41,46.1 v96.27,46.1
  Bottom 0.406: IC5.1 v101.6,30.48 v101.6,41.91 | IC4.1 88.65,72.14 88.65,56.33 88.86,56.12 88.86,55.34 89.63,54.57 90.45,54.57 90.45,53.06 91.44,52.07 91.44,50.93 v96.27,46.1
  Bottom 1.27: X1.7 v111.76,17.78
DIRR_INV
  Bottom 0.406: IC4.8 99.06,59.69 99.06,52.07 IC5.2
ENABLE  (via drill 0.9)
  Top 1.27: v81.28,19.05 81.28,10.16 82.55,8.89 v91.44,8.89
  Bottom 1.27: R25.2 IC3.2 73.66,20.32 74.93,19.05 v81.28,19.05 81.28,21.59 77.47,25.4 77.47,27.94 81.28,31.75 81.28,40.64 80.01,41.91 74.93,41.91 73.66,43.18 IC2.2 R13.2 76.2,50.8 78.74,50.8 81.28,53.34 81.28,63.5 80.64,64.14 | R11.2 IC7.2 73.66,66.04 74.93,64.77 80.01,64.77 80.64,64.14 | IC8.2 73.66,87.63 74.93,86.36 77.47,86.36 78.74,86.36 81.28,83.82 81.28,76.2 78.74,73.66 78.74,69.85 80.64,67.94 80.64,64.14 | v91.44,8.89 X1.9 | 74.24,90.17 76.78,92.71 R12.2
  Bottom 1.778: IC8.2 74.24,89.48 74.24,90.17
GND  (via drill 0.9)
  Top 0.406: v92.71,58.42 87.63,58.42 v86.36,57.15
  Top 1.016: v83.82,11.43 83.82,22.86 R25.1
  Top 1.27: IC10.P$5 132.62,32.16 132.65,32.18 136.73,32.18 LED2.K | IC11.P$3 124.13,55.35 123.28,55.35 121.48,57.15 C7.- | v71.12,73.66 72.39,72.39 72.52,72.39 72.95,72.82 74.36,72.82 74.8,72.39 80.01,72.39 R11.1 81.28,76.2 v83.82,78.74 | 115.57,50.8 v109.22,50.8 v109.22,53.34
  Top 2.54: 115.57,50.8 v116.84,49.53
  Bottom 0.406: IC4.7 v92.71,58.42
  Bottom 1.016: R13.1 83.82,45.72 83.82,43.18 85.09,41.91 92.71,41.91 93.98,43.18 90.17,46.99 90.17,50.8 88.9,52.07 88.9,52.89 89.26,53.25 | IC2.3 71.12,41.91 71.03,42 62.23,42
  Bottom 1.27: IC7.3 71.96,68.15 71.96,68.73 72.03,68.8 72.03,70.34 71.96,70.42 71.96,71.83 72.03,71.9 72.03,72.75 v71.12,73.66 | LED2.K 138.43,33.27 C9.- 142.06,38.99 142.06,42.27 138.07,42.27 D8.A | 114.3,17.78 114.3,16.51 116.84,13.97 X1.3 | 54.18,37.95 54.18,40.79 54,40.96 54,43 55,42 62.23,42 | IC10.P$3 126.15,32.16 124.34,33.96 118.44,33.96 C8.- | 52.83,36.83 52,36 | v86.36,57.15 87.45,56.06 87.45,55.83 87.66,55.62 87.66,54.84 89.26,53.25
  Bottom 1.778: C8.- 115.57,36.83 115.57,48.26 | R12.1 71.12,90.17 IC8.3
  Bottom 2.54: C8.- 118.11,36.83
  pour Bottom (isolate 0.356, rank 5): 0,100.33 149.86,100.33 149.86,0 0,0
IN_L  (via drill 0.9)
  Top 0.406: v90.17,55.88 84.58,50.29 76.96,50.29 76.2,49.53 IC2.1
  Bottom 0.406: 92.71,68.55 IC4.4 92.71,68.55 | 92.71,68.55 89.41,65.25 89.41,56.64 v90.17,55.88
IN_L_INVD  (via drill 0.9)
  Top 0.406: v102.87,68.58 101.6,67.31 97.79,67.31 95.25,64.77 95.25,59.49 94.02,58.27 94.02,57.88 90.71,54.57 90.33,54.57 85.29,49.53 | 85.09,49.53 80.01,49.53 78.74,48.26 78.74,43.18 76.2,40.64 76.2,39.34 77.47,38.07 77.47,35.59 76.2,34.32 v76.2,30.48 | 85.09,49.53 85.29,49.53 | 85.29,49.53 85.09,49.53
  Bottom 0.406: IC4.11 v102.87,68.58
  Bottom 1.27: IC3.1 76.58,21.97 76.58,23.99 75.84,24.73 75.84,28.61 76.58,29.35 76.58,30.48 v76.2,30.48
IN_R  (via drill 0.9)
  Top 1.27: v78.54,67.31 78.74,67.31 80.01,68.58 86.36,68.58 88.9,71.12 v90.17,71.12
  Bottom 1.27: v78.54,67.31 IC7.1 | IC4.3 v90.17,71.12
IN_R_INVD  (via drill 0.9)
  Top 0.406: v102.87,66.04 105.41,68.58 105.41,74.17 v101.09,78.49
  Bottom 1.27: IC8.1 90.68,88.9 v101.09,78.49 | v102.87,66.04 IC4.10
MOTOR_L_+  (via drill 0.9)
  Top 1.27: D3.A 50.8,44.45 Q3.D | v78.74,39.37 C2.- | Q1.S 41.91,30.48
  Top 2.54: Q3.D 40.64,44.45 | 41.91,30.48 40.64,30.48
  Bottom 1.27: D3.A R8.1 69.16,39.37 70.28,38.25 70.28,37.67 IC2.6 71.96,37.67 71.96,38.25 72.95,39.24 78.61,39.24 v78.74,39.37
  pour Top (isolate 0.508): 13.97,60.96 13.97,53.34 27.94,53.34 31.75,49.53 31.75,45.72 38.1,39.37 38.1,34.29 39.37,33.02 39.37,30.48 40.64,29.21 40.64,48.26 38.1,50.8 27.94,60.96 26.67,60.96
MOTOR_L_-
  Top 1.27: Q4.D 49.53,21.59 54.61,16.51 D6.A
  Top 2.54: Q4.D 39.37,21.59 | Q2.S 39.37,7.62 40.64,6.35
  Bottom 0.406: R5.1 68.58,16.51 IC3.6
  Bottom 1.27: R5.1 D6.A | C3.- 72.39,16.51 71.12,15.24 IC3.6
  pour Top (isolate 0.508): 13.97,52.07 13.97,44.45 21.59,40.64 26.67,40.64 31.75,35.56 34.29,33.02 34.29,24.13 34.29,15.24 35.56,13.97 35.56,5.08 41.91,5.08 40.64,6.35 40.64,25.4 40.64,27.94 38.1,30.48 38.1,31.75 36.83,33.02 36.83,38.1 30.48,44.45 30.48,49.53 27.94,52.07
MOTOR_PWM_L  (via drill 0.9)
  Top 0.406: v116.84,16.51 115.57,17.78 115.57,22.86 110.49,27.94 110.49,45.72 106.68,49.53 v106.68,59.69
  Bottom 0.406: X1.2 121.92,8.89 121.92,13.97 119.38,16.51 v116.84,16.51 | IC4.6 97.82,63.5 99.09,62.23 101.6,62.23 102.36,61.47 104.9,61.47 106.17,60.2 | IC4.13 101.6,73.66 106.17,69.09 106.17,67.31 106.17,60.2 | 106.17,60.2 v106.68,59.69
MOTOR_PWM_R  (via drill 0.9)
  Top 0.406: v102.87,63.5 104.14,64.77 105.41,64.77 109.22,60.96 109.22,55.88 107.91,54.57 107.91,49.57 111.76,45.72 111.76,30.48 116.84,25.4 116.84,19.1 v117.15,18.8
  Bottom 0.406: X1.4 116.84,5.08 118.11,3.81 120.65,3.81 123.19,6.35 123.19,13.97 123,13.97 119.7,17.27 118.67,17.27 v117.15,18.8 | IC4.2 98.35,68.02 98.35,65.51 100.33,63.53 IC4.9 v102.87,63.5
MOTOR_R_+  (via drill 0.9)
  Top 0.406: 84.2,59.72 v84.18,59.69
  Top 1.27: 41.91,53.34 Q9.S | D15.A 50.8,67.31 Q10.D 46.99,67.31 | C12.- 101.96,53.7 98.39,53.7 91.68,46.99 | 90.17,46.99 91.68,46.99 | v78.74,62.23 81.64,62.23 v84.18,59.69 | v87.63,49.53 90.17,46.99 | 90.17,46.99 91.68,46.99
  Top 2.54: Q10.D 39.37,67.31 | Q9.S 39.37,53.34 39.37,54.61 38.1,55.88
  Bottom 0.406: R24.1 68.58,62.23 IC7.6
  Bottom 1.27: R24.1 D15.A | v87.63,49.53 84.18,52.98 v84.18,59.69 | IC7.6 71.96,60.53 71.96,61.11 73.08,62.23 v78.74,62.23
  pour Top (isolate 0.762): 15.24,83.82 30.48,83.82 40.64,73.66 40.64,50.8 31.75,59.69 31.75,74.93 30.48,76.2 27.94,76.2 15.24,76.2
MOTOR_R_-  (via drill 0.9)
  Top 1.27: 41.91,90.17 Q12.D 49.53,90.17 D18.A | 40.64,76.2 Q11.S | v78.74,83.82 v101.6,83.82
  Top 2.54: Q12.D 38.1,90.17 | Q11.S 40.64,76.2 39.37,77.47
  Bottom 0.406: R21.1 68.58,83.82 IC8.6 73.66,83.82 v78.74,83.82
  Bottom 1.27: D18.A R21.1 | v101.6,83.82 C13.-
  pour Top (isolate 0.762, rank 2): 15.24,91.44 27.94,91.44 30.48,93.98 31.75,93.98 40.64,93.98 40.64,73.66 30.48,83.82 15.24,83.82
N$1
  Bottom 1.27: D7.C L1.1 120.65,60.53 IC11.P$2
N$2
  Bottom 1.27: R14.1 LED1.A
N$3
  Bottom 1.27: R15.2 LED2.A
N$4
  Bottom 1.27: D8.C L2.1 125.3,35.99 IC10.P$2
N$5
  Top 1.27: D4.C 58.42,46.99 Q3.G
  Bottom 1.27: R2.2 62.23,45.72 R7.2 D4.C
N$6
  Top 1.27: D3.C 49.53,35.56 Q1.G
  Bottom 1.27: D3.C R8.2 59.69,30.48 R1.2
N$7
  Top 1.27: D6.C 49.53,12.7 Q2.G
  Bottom 1.27: R4.1 59.69,7.62 R5.2 D6.C
N$8
  Top 1.27: D5.C 58.42,24.13 Q4.G
  Bottom 1.27: R3.1 62.23,22.86 R6.2 D5.C
N$9
  Bottom 1.27: IC2.4 68.58,46.99 R2.1
N$10
  Bottom 1.27: R1.1 IC2.7
N$11
  Bottom 1.27: IC3.7 R4.2
N$12
  Bottom 1.27: R3.2 68.58,24.13 IC3.4
N$13
  Top 1.27: D16.C 53.34,67.31 50.8,69.85 Q10.G
  Bottom 1.27: D16.C R23.2 62.23,68.58 R18.2
N$30
  Top 1.27: D15.C 49.53,58.42 Q9.G
  Bottom 1.27: D15.C R24.2 59.69,53.34 R17.2
N$31
  Top 1.27: D18.C 55.88,76.2 50.8,81.28 Q11.G
  Bottom 1.27: D18.C R21.2 64.77,76.2 R20.1
N$32
  Top 1.27: Q12.G 52.07,92.71 55.88,88.9 D17.C
  Bottom 1.27: R19.1 63.5,91.44 R22.2 D17.C
N$33
  Bottom 1.27: IC7.4 68.58,69.85 R18.1
N$34
  Bottom 1.27: IC7.7 R17.1
N$35
  Bottom 1.27: R20.2 IC8.7
N$36
  Bottom 1.27: R19.2 68.58,91.44 IC8.4
RESET
  Bottom 1.27: IC9.1 130.81,15.24 133.35,12.7 R9.2 C16.1
VB1
  Top 1.27: C2.+ 81.28,36.83 78.74,34.29 D1.C
  Bottom 1.27: D1.C 76.2,35.56 IC2.8
VB2
  Bottom 1.27: D2.C 76.2,12.7 IC3.8 C3.+
VB3  (via drill 0.9)
  Top 1.27: C12.+ 99.06,52.07 91.44,44.45 | 90.17,44.45 91.44,44.45 | v82.68,51.82 78.74,55.75 D13.C | v87.63,44.45 91.44,44.45
  Bottom 1.27: D13.C 76.2,58.42 IC7.8 | v82.68,51.82 84.61,49.89 84.73,49.89 87.63,46.99 v87.63,44.45
VB4  (via drill 0.9)
  Top 1.27: D14.C 82.55,81.28 v105.41,81.28
  Bottom 1.27: D14.C 76.2,80.01 IC8.8 | C13.+ v105.41,81.28

### Text on the board
Top: LSD-GR1-LST-D-T
Bottom: LSD-GR1-REG-D-+
tStop: LSD-GR1-REG-D-TStop
bStop: LSD-GR1-REG-D-BSTOP